# Altium project mb1045.PrjPCB (part 2 of 3)

## Sheet Memory.SchDoc
size A4; Revision: B.2(PCB.SCH)
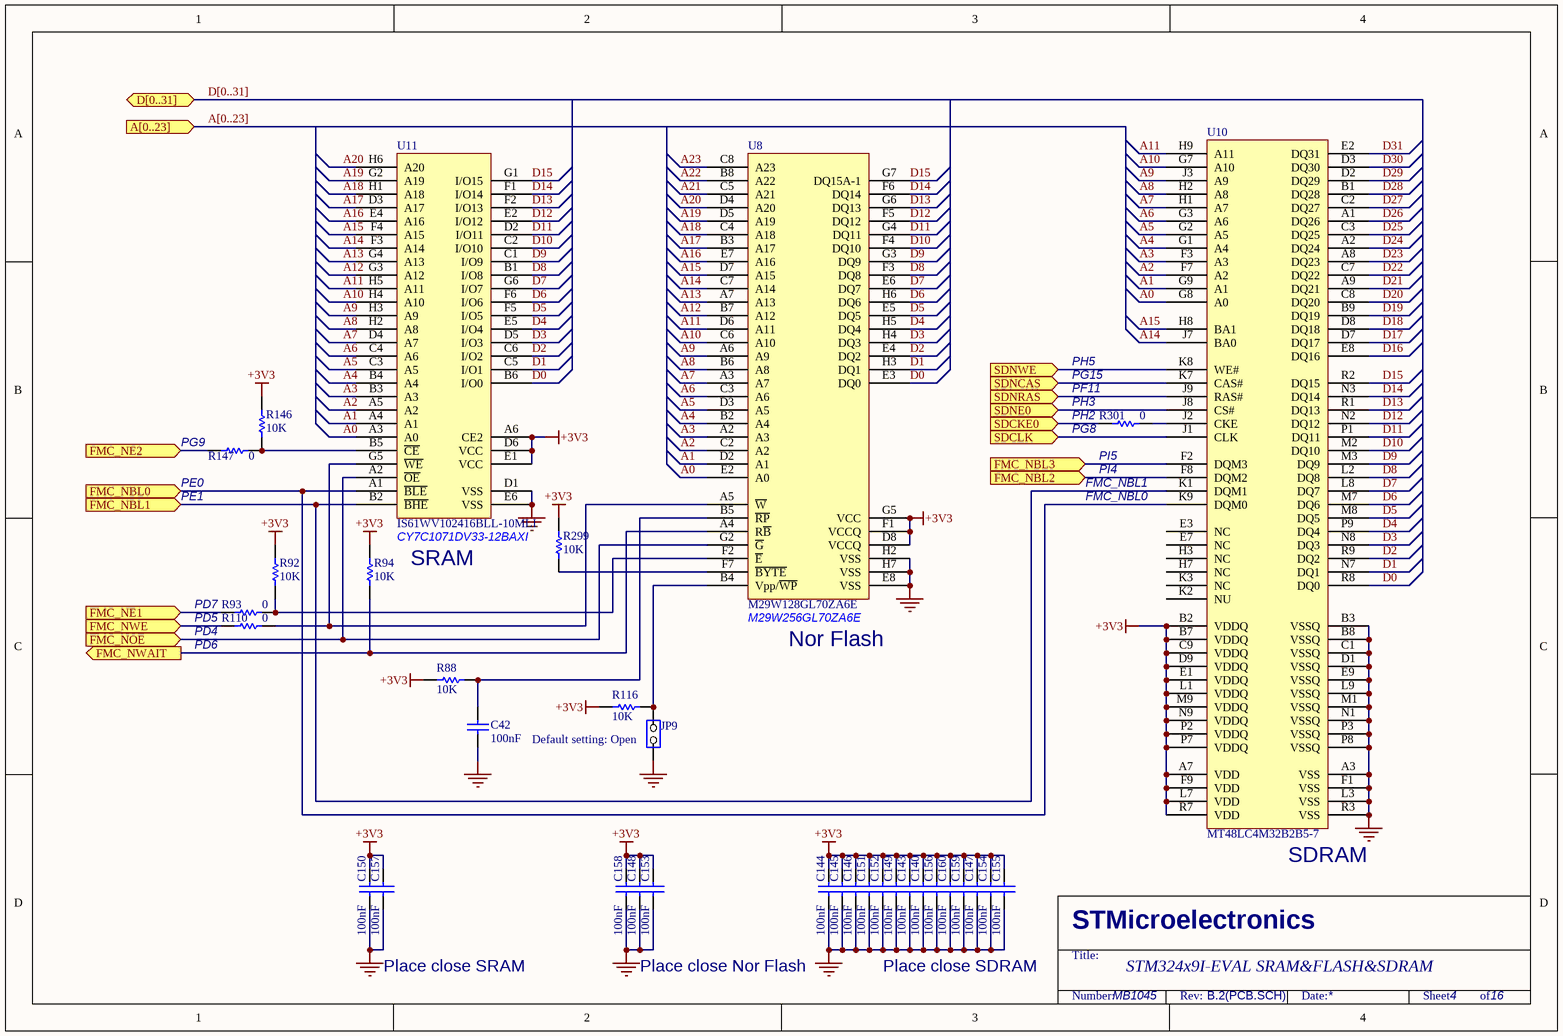
[diagram p4: Memory.SchDoc]

### Parts
C42  100nF  [0603C]
C140  100nF  [0603C]
C143  100nF  [0603C]
C144  100nF  [0603C]
C145  100nF  [0603C]
C146  100nF  [0603C]
C147  100nF  [0603C]
C148  100nF  [0603C]
C149  100nF  [0603C]
C150  100nF  [0603C]
C151  100nF  [0603C]
C152  100nF  [0603C]
C153  100nF  [0603C]
C154  100nF  [0603C]
C155  100nF  [0603C]
C156  100nF  [0603C]
C157  100nF  [0603C]
C158  100nF  [0603C]
C159  100nF  [0603C]
C160  100nF  [0603C]
JP9  (no value)  [SIP2]
R88  10K  [0603R]
R92  10K  [0603R]
R93  0  [0603R]
R94  10K  [0603R]
R110  0  [0603R]
R116  10K  [0603R]
R146  10K  [0603R]
R147  0  [0603R]
R299  10K  [0603R]
R301  0  [0603R]
U8  M29W128GL70ZA6E  [BGA64_1_10X13]
U10  MT48LC4M32B2B5-7  [FBGA90_0R8_8X13]
U11  IS61WV102416BLL-10MLI  [BGA48_0R75_9X11]

### Ports
A[0..23] (in), D[0..31] (bidir), FMC_NBL0 (in), FMC_NBL1 (in), FMC_NBL2 (in), FMC_NBL3 (in), FMC_NE1 (in), FMC_NE2 (in), FMC_NOE (in), FMC_NWAIT (out), FMC_NWE (in), SDCKE0 (in), SDCLK (in), SDNCAS (in), SDNE0 (in), SDNRAS (in), SDNWE (in)

### Nets
+3V3: C140.1 C143.1 C144.1 C145.1 C146.1 C147.1 C148.1 C149.1 C150.1 C151.1 C152.1 C153.1 C154.1 C155.1 C156.1 C157.1 C158.1 C159.1 C160.1 R88.1 R92.2 R94.2 R116.2 R146.2 R299.2 U8.D8(VCCQ) U8.F1(VCCQ) U8.G5(VCC) U10.A7(VDD) U10.B2(VDDQ) U10.B7(VDDQ) U10.C9(VDDQ) U10.D9(VDDQ) U10.E1(VDDQ) U10.F9(VDD) U10.L1(VDDQ) U10.L7(VDD) U10.M9(VDDQ) U10.N9(VDDQ) U10.P2(VDDQ) U10.P7(VDDQ) U10.R7(VDD) U11.A6(CE2) U11.D6(VCC) U11.E1(VCC)
GND: C42.2 C140.2 C143.2 C144.2 C145.2 C146.2 C147.2 C148.2 C149.2 C150.2 C151.2 C152.2 C153.2 C154.2 C155.2 C156.2 C157.2 C158.2 C159.2 C160.2 JP9.1(COMMON) U8.E8(VSS) U8.H2(VSS) U8.H7(VSS) U10.A3(VSS) U10.B3(VSSQ) U10.B8(VSSQ) U10.C1(VSSQ) U10.D1(VSSQ) U10.E9(VSSQ) U10.F1(VSS) U10.L3(VSS) U10.L9(VSSQ) U10.M1(VSSQ) U10.N1(VSSQ) U10.P3(VSSQ) U10.P8(VSSQ) U10.R3(VSS) U11.D1(VSS) U11.E6(VSS)
A0: U8.E2(A0) U10.G8(A0) U11.A3(A0)
A1: U8.D2(A1) U10.G9(A1) U11.A4(A1)
A2: U8.C2(A2) U10.F7(A2) U11.A5(A2)
A3: U8.A2(A3) U10.F3(A3) U11.B3(A3)
A4: U8.B2(A4) U10.G1(A4) U11.B4(A4)
A5: U8.D3(A5) U10.G2(A5) U11.C3(A5)
A6: U8.C3(A6) U10.G3(A6) U11.C4(A6)
A7: U8.A3(A7) U10.H1(A7) U11.D4(A7)
A8: U8.B6(A8) U10.H2(A8) U11.H2(A8)
A9: U8.A6(A9) U10.J3(A9) U11.H3(A9)
A10: U8.C6(A10) U10.G7(A10) U11.H4(A10)
A11: U8.D6(A11) U10.H9(A11) U11.H5(A11)
A12: U8.B7(A12) U11.G3(A12)
A13: U8.A7(A13) U11.G4(A13)
A14: U8.C7(A14) U10.J7(BA0) U11.F3(A14)
A15: U8.D7(A15) U10.H8(BA1) U11.F4(A15)
A16: U8.E7(A16) U11.E4(A16)
A17: U8.B3(A17) U11.D3(A17)
A18: U8.C4(A18) U11.H1(A18)
A19: U8.D5(A19) U11.G2(A19)
A20: U8.D4(A20) U11.H6(A20)
A21: U8.C5(A21)
A22: U8.B8(A22)
A23: U8.C8(A23)
D0: U8.E3(DQ0) U10.R8(DQ0) U11.B6(I/O0)
D1: U8.H3(DQ1) U10.N7(DQ1) U11.C5(I/O1)
D2: U8.E4(DQ2) U10.R9(DQ2) U11.C6(I/O2)
D3: U8.H4(DQ3) U10.N8(DQ3) U11.D5(I/O3)
D4: U8.H5(DQ4) U10.P9(DQ4) U11.E5(I/O4)
D5: U8.E5(DQ5) U10.M8(DQ5) U11.F5(I/O5)
D6: U8.H6(DQ6) U10.M7(DQ6) U11.F6(I/O6)
D7: U8.E6(DQ7) U10.L8(DQ7) U11.G6(I/O7)
D8: U8.F3(DQ8) U10.L2(DQ8) U11.B1(I/O8)
D9: U8.G3(DQ9) U10.M3(DQ9) U11.C1(I/O9)
D10: U8.F4(DQ10) U10.M2(DQ10) U11.C2(I/O10)
D11: U8.G4(DQ11) U10.P1(DQ11) U11.D2(I/O11)
D12: U8.F5(DQ12) U10.N2(DQ12) U11.E2(I/O12)
D13: U8.G6(DQ13) U10.R1(DQ13) U11.F2(I/O13)
D14: U8.F6(DQ14) U10.N3(DQ14) U11.F1(I/O14)
D15: U8.G7(DQ15A-1) U10.R2(DQ15) U11.G1(I/O15)
D16: U10.E8(DQ16)
D17: U10.D7(DQ17)
D18: U10.D8(DQ18)
D19: U10.B9(DQ19)
D20: U10.C8(DQ20)
D21: U10.A9(DQ21)
D22: U10.C7(DQ22)
D23: U10.A8(DQ23)
D24: U10.A2(DQ24)
D25: U10.C3(DQ25)
D26: U10.A1(DQ26)
D27: U10.C2(DQ27)
D28: U10.B1(DQ28)
D29: U10.D2(DQ29)
D30: U10.D3(DQ30)
D31: U10.E2(DQ31)
PD4: U8.G2(~{G}) U11.A2(~{OE}) ; port FMC_NOE
PD5: R110.2 ; port FMC_NWE
PD7: R93.2 ; port FMC_NE1
PE0: U10.K9(DQM0) U11.A1(~{BLE}) ; port FMC_NBL0
PE1: U10.K1(DQM1) U11.B2(~{BHE}) ; port FMC_NBL1
PF11: U10.J9(RAS#) ; port SDNRAS
PG8: U10.J1(CLK) ; port SDCLK
PG9: R147.2 ; port FMC_NE2
PG15: U10.K7(CAS#) ; port SDNCAS
PH2: R301.2 ; port SDCKE0
PH3: U10.J8(CS#) ; port SDNE0
PH5: U10.K8(WE#) ; port SDNWE
PI4: U10.F8(DQM2) ; port FMC_NBL2
PI5: U10.F2(DQM3) ; port FMC_NBL3
NetC42_1: C42.1 R88.2 U8.B5(~{RP})
NetCN12_6: R94.1 U8.A4(R~{B}) ; port FMC_NWAIT
NetJP9_2: JP9.2(NO) R116.1 U8.B4(Vpp/~{WP})
NetR92_1: R92.1 R93.1 U8.F2(~{E})
NetR110_1: R110.1 U8.A5(~{W}) U11.G5(~{WE})
NetR146_1: R146.1 R147.1 U11.B5(~{CE})
NetR299_1: R299.1 U8.F7(~{BYTE})
NetR301_1: R301.1 U10.J2(CKE)

Not connected (* = marked no-connect by the designer): U10 E3(NC) E7(NC) H3(NC) H7(NC) K2(NU) K3(NC)

### Buses and harness runs
bus A[0..23] = port A[0..23]
bus D[0..31] = port D[0..31]

### Notes on the sheet
- PH5
- (near R301) PG15
- (near R147) PG9
- (near R301) PF11
- (near R301) PH3
- (near R301) PH2
- (near R301) PG8
- (near R147) PE1
- (near R147) PE0
- FMC_NBL1
- FMC_NBL0
- (near R301) PI5
- (near R301) PI4
- CY7C1071DV33-12BAXI
- SRAM
- PD5
- PD7
- PD6
- PD4
- (near U8) M29W256GL70ZA6E
- (near U8) Nor Flash
- (near JP9) Default setting: Open
- (near U10) SDRAM
- Place close SRAM
- Place close Nor Flash
- Place close SDRAM
- STM324x9I-EVAL SRAM&FLASH&SDRAM
- MB1045
- 4
- 16
- STMicroelectronics
- Title:
- Number:
- Rev:
- Date:
- Sheet          of

### Library data of the parts
C42 C140 C143-C160 = Cap: Capacitor; Value: 10nF; Published: 8-Jun-2000; Revision: July-2002: Re-released for DXP Platform.; Publisher: Altium Limited
JP9 = JP2
R88 R92-R94 R110 R116 R146 R147 R299 R301 = Res1: Resistor; Value: 1K; Published: 8-Jun-2000; Revision: July-2002: Re-released for DXP Platform.; Publisher: Altium Limited
U8 = M29W128FL70ZA6E
U10 = MT48LC4M32B2B5

## Sheet MotorControl.SchDoc
size A4; Revision: B.2(PCB.SCH)
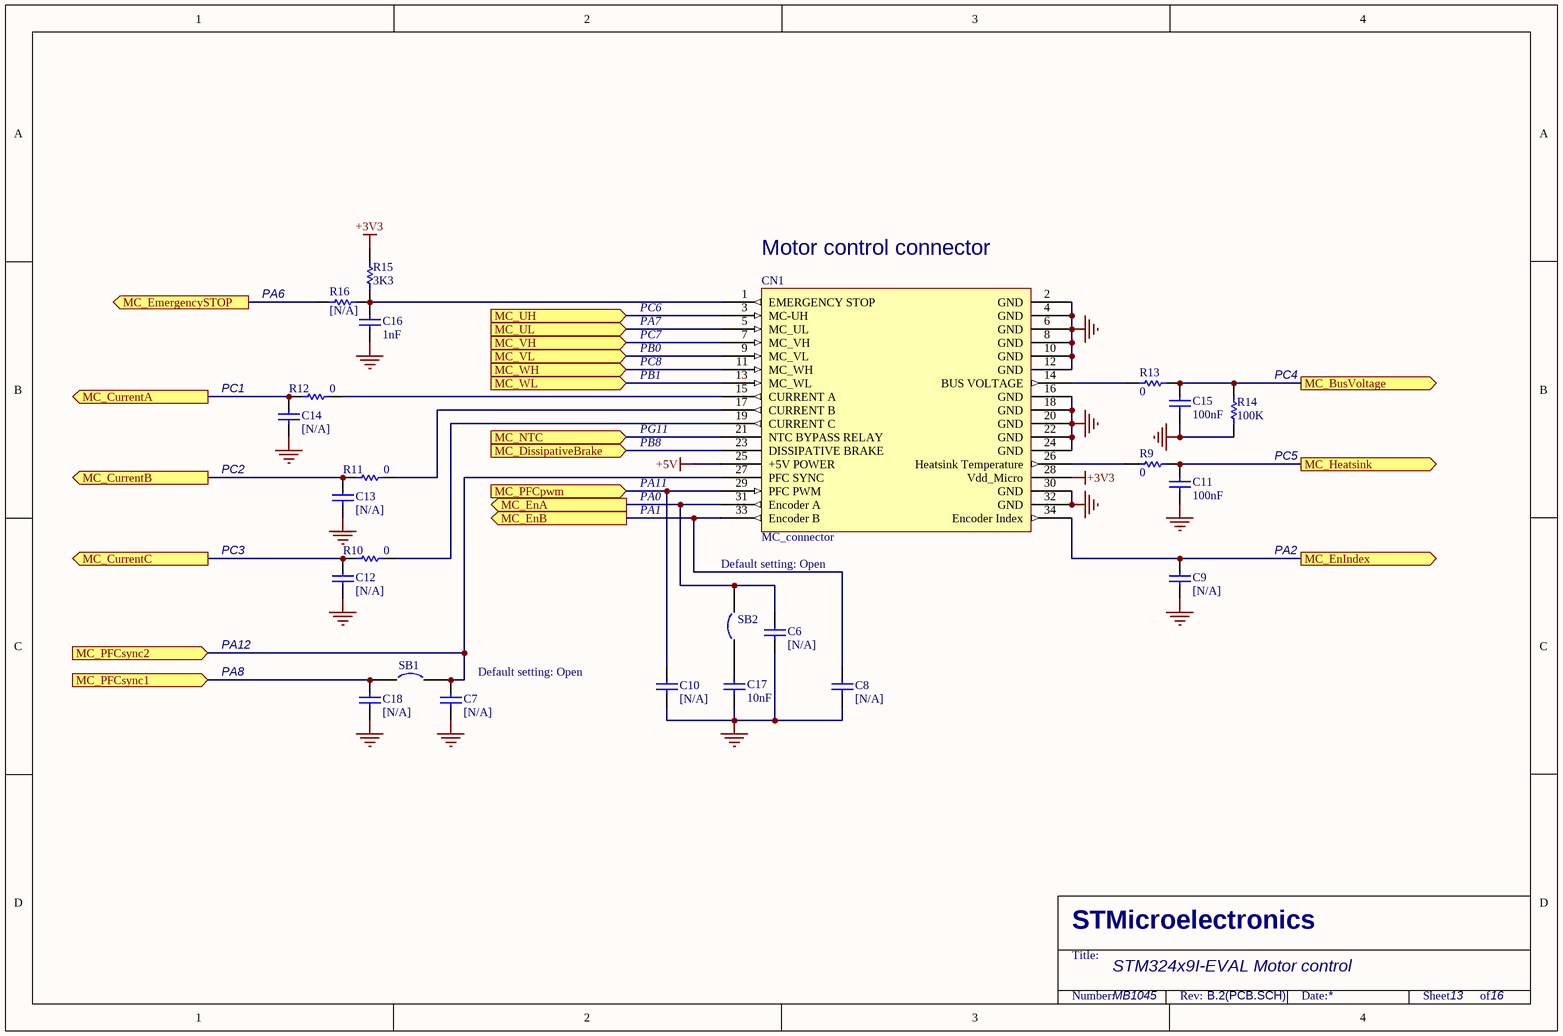
[diagram p5: MotorControl.SchDoc]

### Parts
C6  [N/A]  [0603C]
C7  [N/A]  [0603C]
C8  [N/A]  [0603C]
C9  [N/A]  [0603C]
C10  [N/A]  [0603C]
C11  100nF  [0603C]
C12  [N/A]  [0603C]
C13  [N/A]  [0603C]
C14  [N/A]  [0603C]
C15  100nF  [0603C]
C16  1nF  [0603C]
C17  10nF  [0603C]
C18  [N/A]  [0603C]
CN1  MC_connector  [IDC34S]
R9  0  [0603R]
R10  0  [0603R]
R11  0  [0603R]
R12  0  [0603R]
R13  0  [0603R]
R14  100K  [0603R]
R15  3K3  [0603R]
R16  [N/A]  [0603R]
SB1  (no value)  [JP2_SMD]
SB2  (no value)  [JP2_SMD]

### Ports
MC_BusVoltage (out), MC_CurrentA (out), MC_CurrentB (out), MC_CurrentC (out), MC_DissipativeBrake (in), MC_EmergencySTOP (out), MC_EnA (out), MC_EnB (out), MC_EnIndex (out), MC_Heatsink (out), MC_NTC (in), MC_PFCpwm (in), MC_PFCsync1 (in), MC_PFCsync2 (in), MC_UH (in), MC_UL (in), MC_VH (in), MC_VL (in), MC_WH (in), MC_WL (in)

### Nets
+3V3: CN1.28(Vdd_Micro) R15.2
+5V: CN1.25(+5V_POWER)
GND: C6.1 C7.1 C8.1 C9.1 C10.1 C11.2 C12.1 C13.1 C14.1 C15.2 C16.1 C17.2 C18.1 CN1.2(GND) CN1.4(GND) CN1.6(GND) CN1.8(GND) CN1.10(GND) CN1.12(GND) CN1.16(GND) CN1.18(GND) CN1.20(GND) CN1.22(GND) CN1.24(GND) CN1.30(GND) CN1.32(GND) R14.2
PA6: R16.2 ; port MC_EmergencySTOP
PAR_D1: CN1.7(MC_VH) ; port MC_VH
NetC6_2: C6.2 CN1.31(Encoder_A) SB2.2 ; port MC_EnA
NetC7_2: C7.2 CN1.27(PFC_SYNC) SB1.2 ; port MC_PFCsync2
NetC8_2: C8.2 CN1.33(Encoder_B) ; port MC_EnB
NetC9_2: C9.2 CN1.34(Encoder_Index) ; port MC_EnIndex
NetC10_2: C10.2 CN1.29(PFC_PWM) ; port MC_PFCpwm
NetC11_1: C11.1 R9.2 ; port MC_Heatsink
NetC12_2: C12.2 R10.1 ; port MC_CurrentC
NetC13_2: C13.2 R11.1 ; port MC_CurrentB
NetC14_2: C14.2 R12.1 ; port MC_CurrentA
NetC15_1: C15.1 R13.2 R14.1 ; port MC_BusVoltage
NetC16_2: C16.2 CN1.1(EMERGENCY_STOP) R15.1 R16.1
NetC17_1: C17.1 SB2.1
NetC18_2: C18.2 SB1.1 ; port MC_PFCsync1
NetCN1_3: CN1.3(MC-UH) ; port MC_UH
NetCN1_5: CN1.5(MC_UL) ; port MC_UL
NetCN1_9: CN1.9(MC_VL) ; port MC_VL
NetCN1_11: CN1.11(MC_WH) ; port MC_WH
NetCN1_13: CN1.13(MC_WL) ; port MC_WL
NetCN1_14: CN1.14(BUS_VOLTAGE) R13.1
NetCN1_15: CN1.15(CURRENT_A) R12.2
NetCN1_17: CN1.17(CURRENT_B) R11.2
NetCN1_19: CN1.19(CURRENT_C) R10.2
NetCN1_21: CN1.21(NTC_BYPASS_RELAY) ; port MC_NTC
NetCN1_23: CN1.23(DISSIPATIVE_BRAKE) ; port MC_DissipativeBrake
NetCN1_26: CN1.26(Heatsink_Temperature) R9.1

### Notes on the sheet
- (near R16) PA6
- PC6
- (near CN1) Motor control connector
- PA7
- PB0
- PB1
- PC7
- PC8
- (near R14) PC4
- PC1
- PG11
- PB8
- PC2
- PA1
- PA0
- PA11
- (near R14) PC5
- PC3
- Default setting: Open
- PA2
- PA12
- PA8
- (near C7) Default setting: Open
- STM324x9I-EVAL Motor control
- MB1045
- 13
- 16
- STMicroelectronics
- Title:
- Number:
- Rev:
- Date:
- Sheet          of

### Library data of the parts
C6-C10 C12-C14 C18 = cap: Capacitor; Value: 100pF; Published: 8-Jun-2000; Revision: July-2002: Re-released for DXP Platform.; Publisher: Altium Limited
C11 C15 = Cap: Capacitor; Value: 10nF; Published: 8-Jun-2000; Revision: July-2002: Re-released for DXP Platform.; Publisher: Altium Limited
C16 C17 = CAP: Capacitor; Value: 100pF; Published: 8-Jun-2000; Revision: July-2002: Re-released for DXP Platform.; Publisher: Altium Limited
R9-R13 R15 R16 = Res1: Resistor; Value: 1K; Published: 8-Jun-2000; Revision: July-2002: Re-released for DXP Platform.; Publisher: Altium Limited
R14 = res1: Resistor; Value: 1K; Published: 8-Jun-2000; Revision: July-2002: Re-released for DXP Platform.; Publisher: Altium Limited
SB1 SB2 = Circuit Breaker: Published: 24-Mar-1999; Revision: July-2002: Re-released for DXP Platform.; Publisher: Altium Limited

## Sheet Peripherals.SchDoc
size A4; Revision: B.2(PCB.SCH)
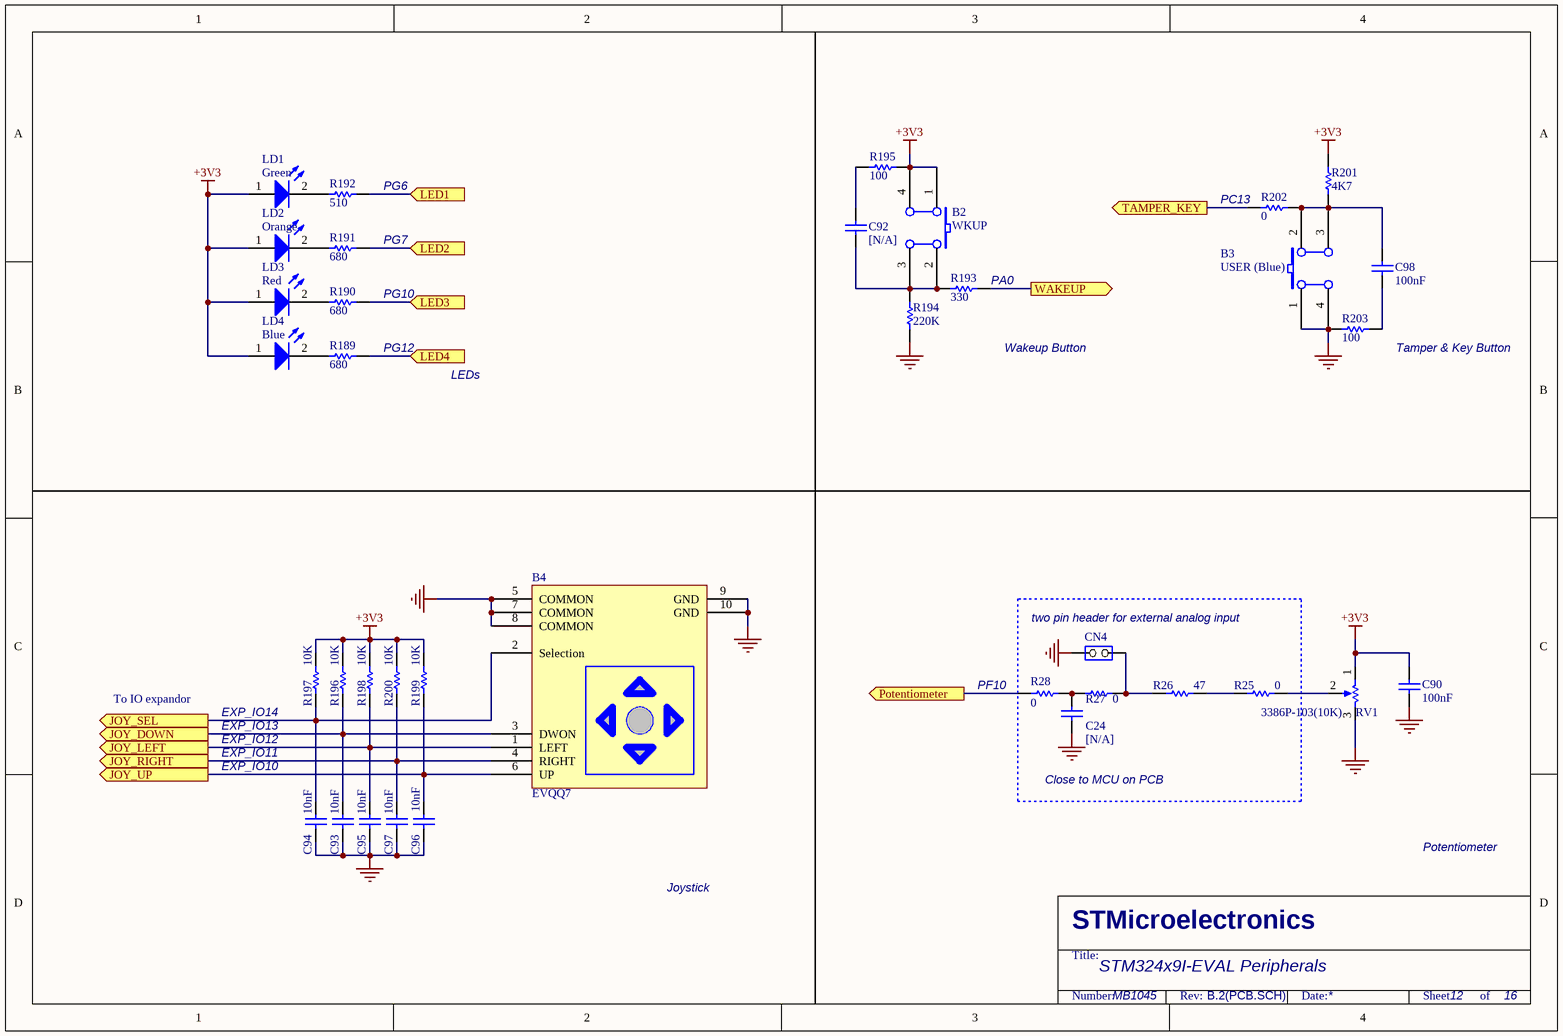
[diagram p6: Peripherals.SchDoc]

### Parts
B2  WKUP  [PB10]
B3  USER (Blue)  [PB10]
B4  EVQQ7  [SW-JOY]
C24  [N/A]  [0603C]
C90  100nF  [0603C]
C92  [N/A]  [0603C]
C93  10nF  [0603C]
C94  10nF  [0603C]
C95  10nF  [0603C]
C96  10nF  [0603C]
C97  10nF  [0603C]
C98  100nF  [0603C]
CN4  (no value)  [SIP2]
LD1  Green  [0603D]
LD2  Orange  [0603D]
LD3  Red  [0603D]
LD4  Blue  [0603D]
R25  0  [0603R]
R26  47  [0603R]
R27  0  [0603R]
R28  0  [0603R]
R189  680  [0603R]
R190  680  [0603R]
R191  680  [0603R]
R192  510  [0603R]
R193  330  [0603R]
R194  220K  [0603R]
R195  100  [0603R]
R196  10K  [0603R]
R197  10K  [0603R]
R198  10K  [0603R]
R199  10K  [0603R]
R200  10K  [0603R]
R201  4K7  [0603R]
R202  0  [0603R]
R203  100  [0603R]
RV1  3386P-103(10K)  [3386P]

### Ports
JOY_DOWN (out), JOY_LEFT (out), JOY_RIGHT (out), JOY_SEL (out), JOY_UP (out), LED1 (in), LED2 (in), LED3 (in), LED4 (in), Potentiometer (out), TAMPER_KEY (out), WAKEUP (out)

### Nets
+3V3: B2.1(A0) B2.4(A1) C90.1 LD1.1(A) LD2.1(A) LD3.1(A) LD4.1(A) R195.1 R196.1 R197.1 R198.1 R199.1 R200.1 R201.2 RV1.1(BOT)
GND: B3.1(A0) B3.4(A1) B4.5(COMMON) B4.7(COMMON) B4.8(COMMON) B4.9(GND) B4.10(GND) C24.1 C90.2 C93.1 C94.1 C95.1 C96.1 C97.1 CN4.2(NO) R194.2 R203.1 RV1.3(TOP)
PC13: R202.2 ; port TAMPER_KEY
PF10: R28.2 ; port Potentiometer
PG6: R192.1 ; port LED1
PG7: R191.1 ; port LED2
PG10: R190.1 ; port LED3
PG12: R189.1 ; port LED4
NetB2_2: B2.2(B0) B2.3(B1) C92.2 R193.1 R194.1
NetB3_2: B3.2(B0) B3.3(B1) C98.2 R201.1 R202.1
NetB4_1: B4.1(LEFT) C95.2 R198.2 ; port JOY_LEFT
NetB4_2: B4.2(Selection) C94.2 R197.2 ; port JOY_SEL
NetB4_3: B4.3(DWON) C93.2 R196.2 ; port JOY_DOWN
NetB4_4: B4.4(RIGHT) C97.2 R200.2 ; port JOY_RIGHT
NetB4_6: B4.6(UP) C96.2 R199.2 ; port JOY_UP
NetC24_2: C24.2 R27.1 R28.1
NetC92_1: C92.1 R195.2
NetC98_1: C98.1 R203.2
NetCN4_1: CN4.1(COMMON) R26.1 R27.2
NetLD1_2: LD1.2(K) R192.2
NetLD2_2: LD2.2(K) R191.2
NetLD3_2: LD3.2(K) R190.2
NetLD4_2: LD4.2(K) R189.2
NetR25_1: R25.1 R26.2
NetR25_2: R25.2 RV1.2(TAP)
NetR193_2: R193.2 ; port WAKEUP

### Notes on the sheet
- (near R192) PG6
- (near R191) PG7
- (near R202) PC13
- (near R190) PG10
- (near R193) PA0
- (near R189) PG12
- LEDs
- Wakeup Button
- (near R203) Tamper & Key Button
- (near CN4) two pin header for external analog input
- To IO expandor
- EXP_IO14
- (near R28) PF10
- EXP_IO10
- EXP_IO11
- EXP_IO12
- EXP_IO13
- Close to MCU on PCB
- Potentiometer
- Joystick
- STM324x9I-EVAL Peripherals
- MB1045
- 12
- 16
- STMicroelectronics
- Title:
- Number:
- Rev:
- Date:
- Sheet          of

### Library data of the parts
B2 B3 = SW PUSHBUTTON: SE PUSHBUTTON
C24 = cap: Capacitor; Value: 100pF; Published: 8-Jun-2000; Revision: July-2002: Re-released for DXP Platform.; Publisher: Altium Limited
C90 C92-C98 = CAP: Capacitor; Value: 100pF; Published: 8-Jun-2000; Revision: July-2002: Re-released for DXP Platform.; Publisher: Altium Limited
CN4 = JP2
LD1-LD4 = LED2: Typical RED, GREEN, YELLOW, AMBER GaAs LED; Published: 8-Jun-2000; Revision: July-2002: Re-released for DXP Platform.; Publisher: Altium Limited
R25-R28 R189-R193 R195 R202 R203 = Res1: Resistor; Value: 1K; Published: 8-Jun-2000; Revision: July-2002: Re-released for DXP Platform.; Publisher: Altium Limited
R194 R196-R201 = res1: Resistor; Value: 1K; Published: 8-Jun-2000; Revision: July-2002: Re-released for DXP Platform.; Publisher: Altium Limited
RV1 = RV

## Sheet Power.SchDoc
size A4; Revision: B.2(PCB.SCH)
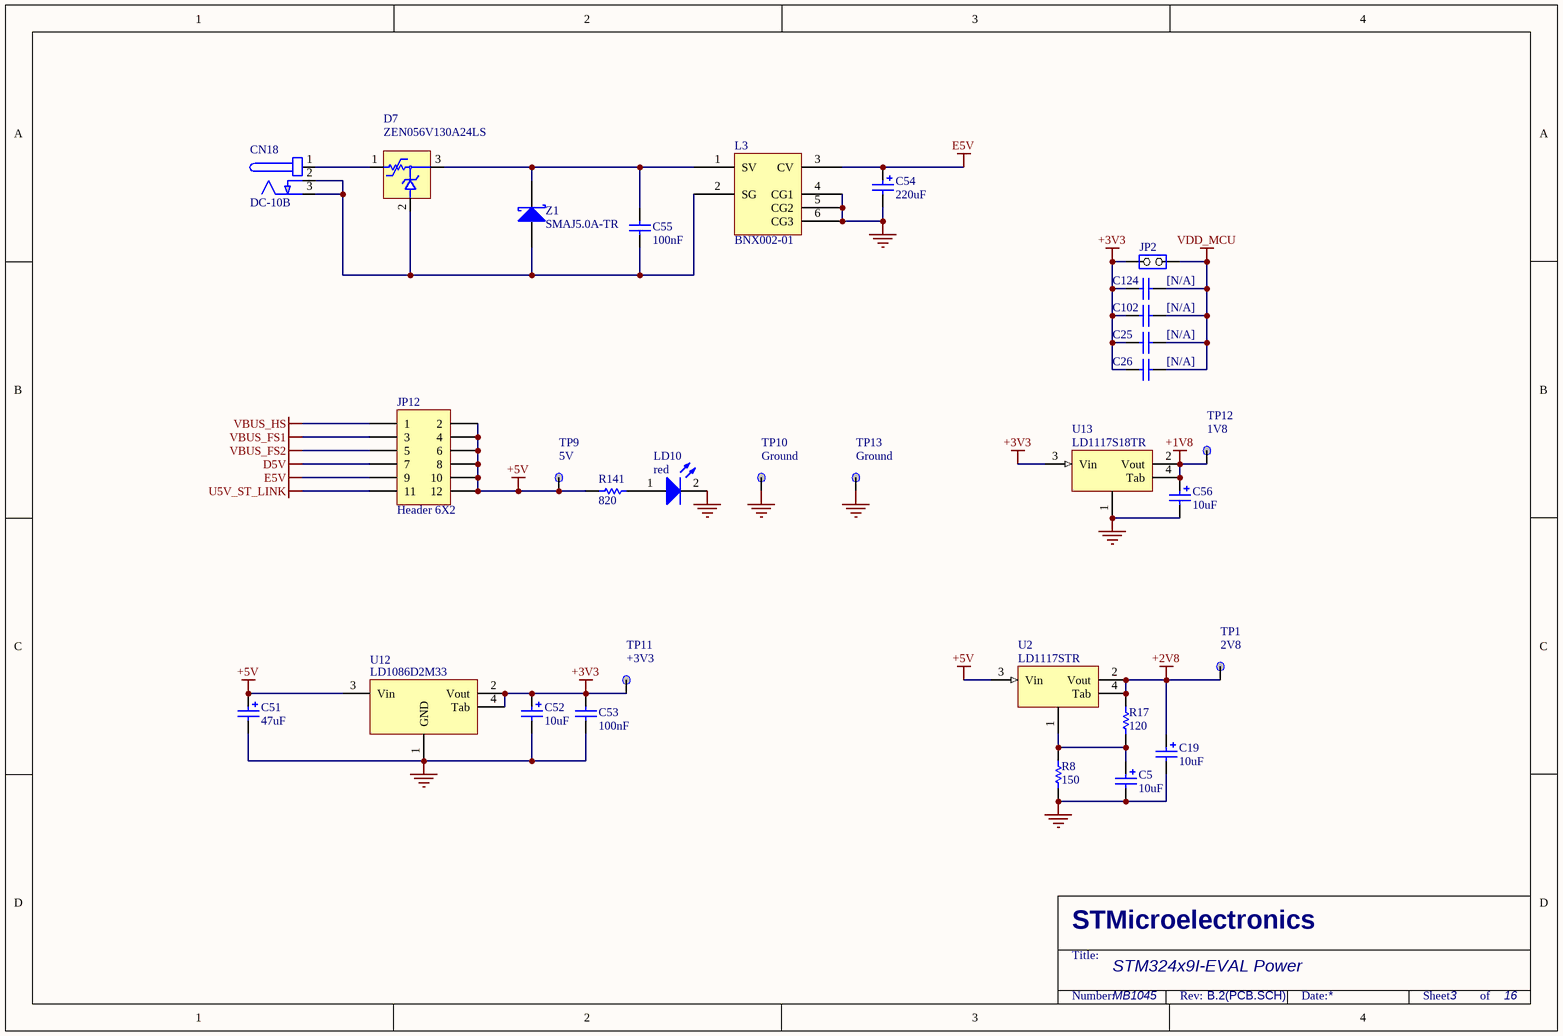
[diagram p7: Power.SchDoc]

### Parts
C5  10uF  [TAN-A]
C19  10uF  [TAN-A]
C25  [N/A]  [0603C]
C26  [N/A]  [0603C]
C51  47uF  [CAE_5R3X5R3_H5R4]
C52  10uF  [TAN-A]
C53  100nF  [0603C]
C54  220uF  [c310m-6]
C55  100nF  [0603C]
C56  10uF  [TAN-A]
C102  [N/A]  [0603C]
C124  [N/A]  [0603C]
CN18  DC-10B  [PWR_JACK_DC10]
D7  ZEN056V130A24LS  [TYCO_ZEN056V130A24LS]
JP2  (no value)  [SIP2]
JP12  Header 6X2  [HDR_2X6_2R54]
L3  BNX002-01  [BNX001]
LD10  red  [0603D]
R8  150  [0603R]
R17  120  [0603R]
R141  820  [0603R]
TP1  2V8  [TP]
TP9  5V  [TP]
TP10  Ground  [TP]
TP11  +3V3  [TP]
TP12  1V8  [TP]
TP13  Ground  [TP]
U2  LD1117STR  [SOT-223]
U12  LD1086D2M33  [TO263-3]
U13  LD1117S18TR  [SOT-223]
Z1  SMAJ5.0A-TR  [sma]

### Nets
+1V8: C56.1 TP12.1 U13.2(Vout) U13.4(Tab)
+2V8: C19.1 R17.1 TP1.1 U2.2(Vout) U2.4(Tab)
+3V3: C25.1 C26.1 C52.1 C53.1 C102.1 C124.1 JP2.1(COMMON) TP11.1 U12.2(Vout) U12.4(Tab) U13.3(Vin)
+5V: C51.1 JP12.2 JP12.4 JP12.6 JP12.8 JP12.10 JP12.12 R141.2 TP9.1 U2.3(Vin) U12.3(Vin)
D5V: JP12.7
E5V: C54.1 JP12.9 L3.3(CV)
GND: C5.2 C19.2 C51.2 C52.2 C53.2 C54.2 C56.2 L3.4(CG1) L3.5(CG2) L3.6(CG3) LD10.2(K) R8.2 TP10.1 TP13.1 U12.1(GND) U13.1
U5V_ST_LINK: JP12.11
VBUS_FS1: JP12.3
VBUS_FS2: JP12.5
VBUS_HS: JP12.1
VDD_MCU: C25.2 C26.2 C102.2 C124.2 JP2.2(NO)
NetC5_1: C5.1 R8.1 R17.2 U2.1
NetC55_1: C55.1 D7.3 L3.1(SV) Z1.2(K)
NetC55_2: C55.2 CN18.2(GND) CN18.3(GND) D7.2 L3.2(SG) Z1.1(A)
NetCN18_1: CN18.1(+) D7.1
NetLD10_1: LD10.1(A) R141.1

### Notes on the sheet
- STM324x9I-EVAL Power
- MB1045
- 3
- 16
- STMicroelectronics
- Title:
- Number:
- Rev:
- Date:
- Sheet          of

### Library data of the parts
C5 C19 C52 C56 = Cap Pol1: Polarized Capacitor (Radial); Published: 8-Jun-2000; Revision: July-2002: Re-released for DXP Platform.; Publisher: Altium Limited; Value: 10uF
C25 C26 C53 C102 C124 = Cap: Capacitor; Value: 10nF; Published: 8-Jun-2000; Revision: July-2002: Re-released for DXP Platform.; Publisher: Altium Limited
C51 = Cap Pol1: Polarized Capacitor (Radial); Value: 10uF; Published: 8-Jun-2000; Revision: July-2002: Re-released for DXP Platform.; Publisher: Altium Limited
C54 = Cap Pol1: Polarized Capacitor (Radial); Value: 47uF; Published: 8-Jun-2000; Revision: July-2002: Re-released for DXP Platform.; Publisher: Altium Limited
C55 = CAP: Capacitor; Value: 100pF; Published: 8-Jun-2000; Revision: July-2002: Re-released for DXP Platform.; Publisher: Altium Limited
CN18 = PJ202A
JP2 = JP2
JP12 = Header 6X2: Header, 6-Pin, Dual row; Revision: 17-Jul-2002: Re-released for DXP Platform.; Publisher: Altium Limited
L3 = BNX002
LD10 = LED2: as LD1 on sheet Peripherals; Published: 8-Jun-2000; Revision: July-2002: Re-released for DXP Platform.; Publisher: Altium Limited
R8 R17 R141 = res1: Resistor; Value: 1K; Published: 8-Jun-2000; Revision: July-2002: Re-released for DXP Platform.; Publisher: Altium Limited
TP1 TP9-TP13 = TP
U2 U13 = LD1117
U12 = VOLTREG1
Z1 = D Schottky: Schottky Diode; Code - JEDEC: DO-214-AA; Published: 8-Jun-2000; Revision: July-2002: Re-released for DXP Platform.; Publisher: Altium Limited

## Sheet RS232&IrDA.SchDoc
size A4; Revision: B.2(PCB.SCH)
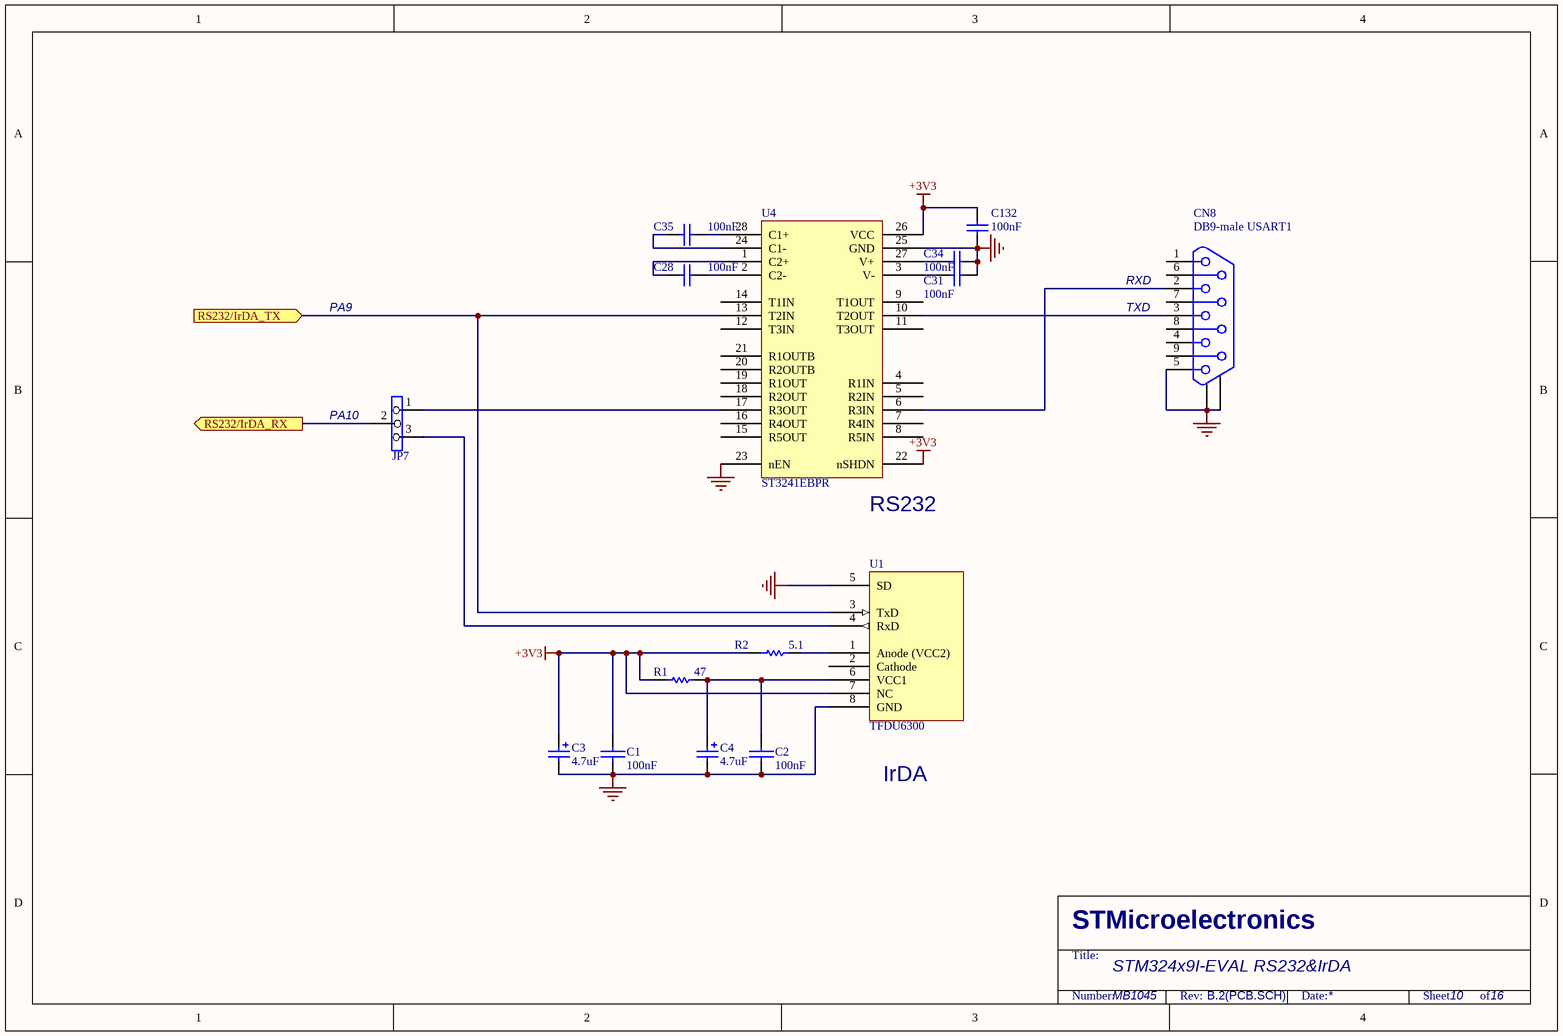
[diagram p8: RS232&IrDA.SchDoc]

### Parts
C1  100nF  [0603C]
C2  100nF  [0603C]
C3  4.7uF  [TAN-A]
C4  4.7uF  [TAN-A]
C28  100nF  [0603C]
C31  100nF  [0603C]
C34  100nF  [0603C]
C35  100nF  [0603C]
C132  100nF  [0603C]
CN8  DB9-male USART1  [DB9/M]
JP7  (no value)  [SIP3]
R1  47  [0603R]
R2  5.1  [0603R]
U1  TFDU6300  [IR_VISHAY3]
U4  ST3241EBPR  [SSOP28_0R65_10R2X7R8]

### Ports
RS232/IrDA_RX (out), RS232/IrDA_TX (in)

### Nets
+3V3: C1.1 C3.1 C132.1 R1.1 R2.1 U1.7(NC) U4.22(nSHDN) U4.26(VCC)
GND: C1.2 C2.2 C3.2 C4.2 C31.1 C34.1 C132.2 CN8.5 CN8.10 CN8.11 U1.5(SD) U1.8(GND) U4.23(nEN) U4.25(GND)
PA10: JP7.2 ; port RS232/IrDA_RX
NetC2_1: C2.1 C4.1 R1.2 U1.6(VCC1)
NetC28_1: C28.1 U4.1(C2+)
NetC28_2: C28.2 U4.2(C2-)
NetC31_2: C31.2 U4.3(V-)
NetC34_2: C34.2 U4.27(V+)
NetC35_1: C35.1 U4.24(C1-)
NetC35_2: C35.2 U4.28(C1+)
NetCN8_2: CN8.2 U4.6(R3IN)
NetCN8_3: CN8.3 U4.10(T2OUT)
NetJP7_1: JP7.1 U4.17(R3OUT)
NetJP7_3: JP7.3 U1.4(RxD)
NetR2_2: R2.2 U1.1(Anode_(VCC2))
NetR262_2: U1.3(TxD) U4.13(T2IN) ; port RS232/IrDA_TX

Not connected (* = marked no-connect by the designer): CN8 1 4 6 7 8 9; U1 2(Cathode); U4 4(R1IN) 5(R2IN) 7(R4IN) 8(R5IN) 9(T1OUT) 11(T3OUT) 12(T3IN) 14(T1IN) 15(R5OUT) 16(R4OUT) 18(R2OUT) 19(R1OUT) 20(R2OUTB) 21(R1OUTB)

### Notes on the sheet
- PA9
- (near CN8) RXD
- (near CN8) TXD
- (near JP7) PA10
- (near U4) RS232
- IrDA
- STM324x9I-EVAL RS232&IrDA
- MB1045
- 10
- 16
- STMicroelectronics
- Title:
- Number:
- Rev:
- Date:
- Sheet          of

### Library data of the parts
C1 C2 = CAP: Capacitor
C3 C4 = Cap Pol1: Polarized Capacitor (Radial); Value: 100pF; Published: 8-Jun-2000; Revision: July-2002: Re-released for DXP Platform.; Publisher: Altium Limited
C28 C31 C34 C35 C132 = Cap: Capacitor; Value: 10nF; Published: 8-Jun-2000; Revision: July-2002: Re-released for DXP Platform.; Publisher: Altium Limited
CN8 = DB9-USART
JP7 = Jumper3
R1 R2 = Res1: Resistor; Value: 1K; Published: 8-Jun-2000; Revision: July-2002: Re-released for DXP Platform.; Publisher: Altium Limited
U1 = TFDU4300
U4 = ST3241

## Sheet ST_LINK.SCHDOC
size A4; Revision: B.2(PCB.SCH)
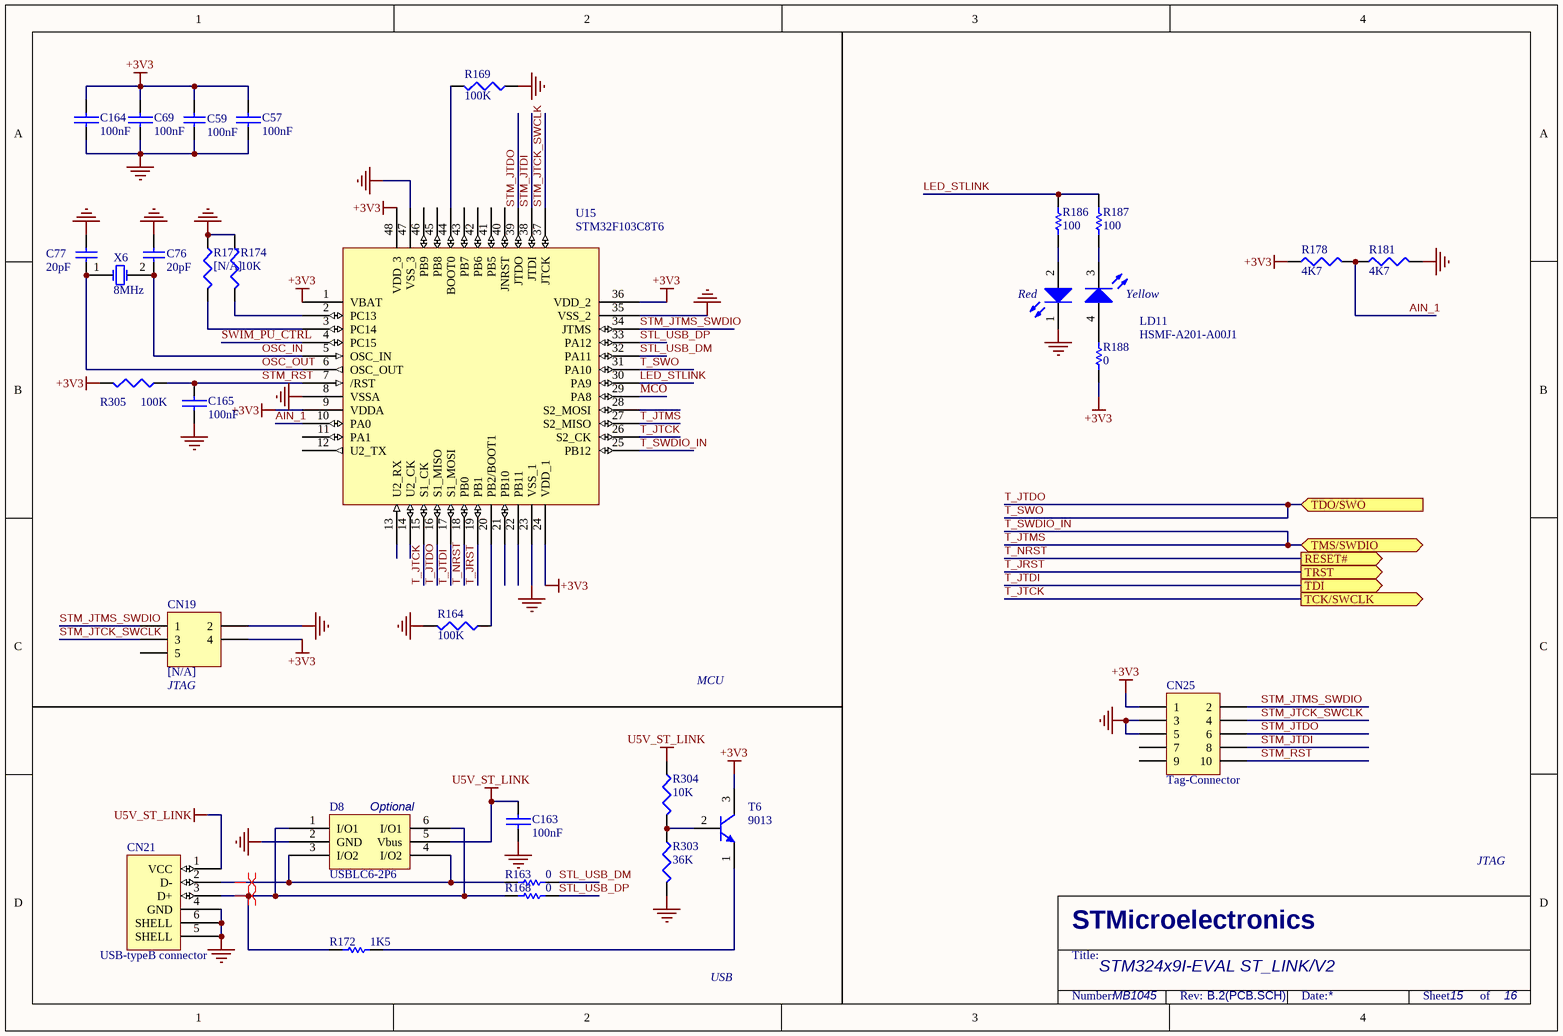
[diagram p9: ST_LINK.SCHDOC]

### Parts
C57  100nF  [0603C]
C59  100nF  [0603C]
C69  100nF  [0603C]
C76  20pF  [0603C]
C77  20pF  [0603C]
C163  100nF  [0603C]
C164  100nF  [0603C]
C165  100nF  [0603C]
CN19  [N/A]  [HDR_2X3-1_2R54-6]
CN21  USB-typeB connector  [USB-B]
CN25  Tag-Connector  [TC2050-IDC-FP]
D8  USBLC6-2P6  [SOT-563]
LD11  HSMF-A201-A00J1  [LED2_3528]
R163  0  [0603R]
R164  100K  [0603R]
R168  0  [0603R]
R169  100K  [0603R]
R172  1K5  [0603R]
R174  10K  [0603R]
R177  [N/A]  [0603R]
R178  4K7  [0603R]
R181  4K7  [0603R]
R186  100  [0603R]
R187  100  [0603R]
R188  0  [0603R]
R303  36K  [0603R]
R304  10K  [0603R]
R305  100K  [0603R]
T6  9013  [SOT23-213]
U15  STM32F103C8T6  [LQFP48_0R5_9X9]
X6  8MHz  [XTAL_2SM_12R7X4R7]

### Ports
RESET# (out), TCK/SWCLK (out), TDI (out), TDO/SWO (in), TMS/SWDIO (bidir), TRST (out)

### Nets
+3V3: C57.2 C59.1 C69.2 C164.2 CN19.4 CN25.1 R178.1 R188.2 R305.2 T6.3(C) U15.1(VBAT) U15.9(VDDA) U15.24(VDD_1) U15.36(VDD_2) U15.48(VDD_3)
GND: C57.1 C59.2 C69.1 C76.1 C77.1 C163.2 C164.1 C165.1 CN19.2 CN21.4(GND) CN21.5(SHELL) CN21.6(SHELL) CN25.3 CN25.5 D8.2(GND) LD11.1(RED_cathode) R164.2 R169.1 R174.1 R177.1 R181.2 R303.2 U15.8(VSSA) U15.23(VSS_1) U15.35(VSS_2) U15.47(VSS_3)
U5V_ST_LINK: C163.1 CN21.1(VCC) D8.5(Vbus) R304.1
AIN_1: R178.2 R181.1 U15.10(PA0)
LED_STLINK: R186.1 R187.1 U15.30(PA9)
MCO: U15.29(PA8)
OSC_IN: C76.2 U15.5(OSC_IN) X6.2(OSC2)
OSC_OUT: C77.2 U15.6(OSC_OUT) X6.1(OSC1)
STL_USB_DM: R163.1 U15.32(PA11)
STL_USB_DP: R168.1 U15.33(PA12)
STM_JTCK_SWCLK: CN19.3 CN25.4 U15.37(JTCK)
STM_JTDI: CN25.8 U15.38(JTDI)
STM_JTDO: CN25.6 U15.39(JTDO)
STM_JTMS_SWDIO: CN19.1 CN25.2 U15.34(JTMS)
STM_RST: C165.2 CN25.10 R305.1 U15.7(/RST)
SWIM_PU_CTRL: U15.4(PC15)
T_JRST: U15.19(PB1) ; port TRST  [project net PB4]
T_JTCK: U15.15(S1_CK) U15.26(S2_CK) ; port TCK/SWCLK  [project net PA14]
T_JTDI: U15.17(S1_MOSI) ; port TDI  [project net PA15]
T_JTDO: U15.16(S1_MISO) U15.31(PA10) ; port TDO/SWO  [also labelled T_SWO]
T_JTMS: U15.25(PB12) U15.27(S2_MISO) ; port TMS/SWDIO  [also labelled T_SWDIO_IN]  [project net PA13]
T_NRST: U15.18(PB0) ; port RESET#  [project net RESET#]
NetCN21_2: CN21.2(D-) D8.3(I/O2) D8.4(I/O2) R163.2
NetCN21_3: CN21.3(D+) D8.1(I/O1) D8.6(I/O1) R168.2 R172.2
NetLD11_2: LD11.2(Red_anode) R186.2
NetLD11_3: LD11.3(YellowGreen_cathode) R187.2
NetLD11_4: LD11.4(YellowGreen_anode) R188.1
NetR164_1: R164.1 U15.20(PB2/BOOT1)
NetR169_2: R169.2 U15.44(BOOT0)
NetR172_1: R172.1 T6.1(E)
NetR174_2: R174.2 U15.2(PC13)
NetR177_2: R177.2 U15.3(PC14)
NetR303_1: R303.1 R304.2 T6.2(B)

Not connected (* = marked no-connect by the designer): CN19 5; CN25 7 9; U15 11(PA1) 12(U2_TX) 13(U2_RX) 14(U2_CK) 21(PB10) 22(PB11) 28(S2_MOSI) 40(JNRST) 41(PB5) 42(PB6) 43(PB7) 45(PB8) 46(PB9)

### Layout directives
differential pair: NetCN21_2, NetCN21_3

### Notes on the sheet
- (near CN19) JTAG
- MCU
- (near D8) Optional
- JTAG
- USB
- STM324x9I-EVAL ST_LINK/V2
- MB1045
- 15
- 16
- STMicroelectronics
- Title:
- Number:
- Rev:
- Date:
- Sheet          of
- (in symbol HSMF-A201-A00J1) Red; Yellow

### Library data of the parts
C57 C69 C164 C165 = CAP
C59 = Cap: Capacitor; Value: 10nF; Published: 8-Jun-2000; Revision: July-2002: Re-released for DXP Platform.; Publisher: Altium Limited
C76 C77 = Cap: Capacitor; Published: 8-Jun-2000; LatestRevisionDate: 17-Jul-2002; LatestRevisionNote: Re-released for DXP Platform.; PackageReference: RAD-0.3; Publisher: Altium Limited; Value: 20pF
C163 = CAP: Capacitor
CN19 = Header 3X2: Header, 3-Pin, Dual row; Revision: 17-Jul-2002: Re-released for DXP Platform.; Publisher: Altium Limited
CN25 = Tag-Connector: Header, 6-Pin, Dual row; Revision: 17-Jul-2002: Re-released for DXP Platform.; Publisher: Altium Limited
D8 = USBLC6-2
R163 R168 R172 R186-R188 = Res1: Resistor; Value: 1K; Published: 8-Jun-2000; Revision: July-2002: Re-released for DXP Platform.; Publisher: Altium Limited
R164 R169 R178 R181 R305 = RES1
R174 R177 R303 R304 = R: Right: 20; Bottom: 30
T6 = NPN: NPN Bipolar Transistor; Code - JEDEC: TO-226-AA; Published: 8-Jun-2000; Revision: July-2002: Re-released for DXP Platform.; Publisher: Altium Limited
U15 = STM32F10x(48pin)
X6 = XTAL: Crystal Oscillator; Published: 8-Jun-2000; LatestRevisionDate: 17-Jul-2002; LatestRevisionNote: Re-released for DXP Platform.; PackageReference: R38; Publisher: Altium Limited

## Sheet USB_OTG.SchDoc
size A4; Revision: B.2(PCB.SCH)
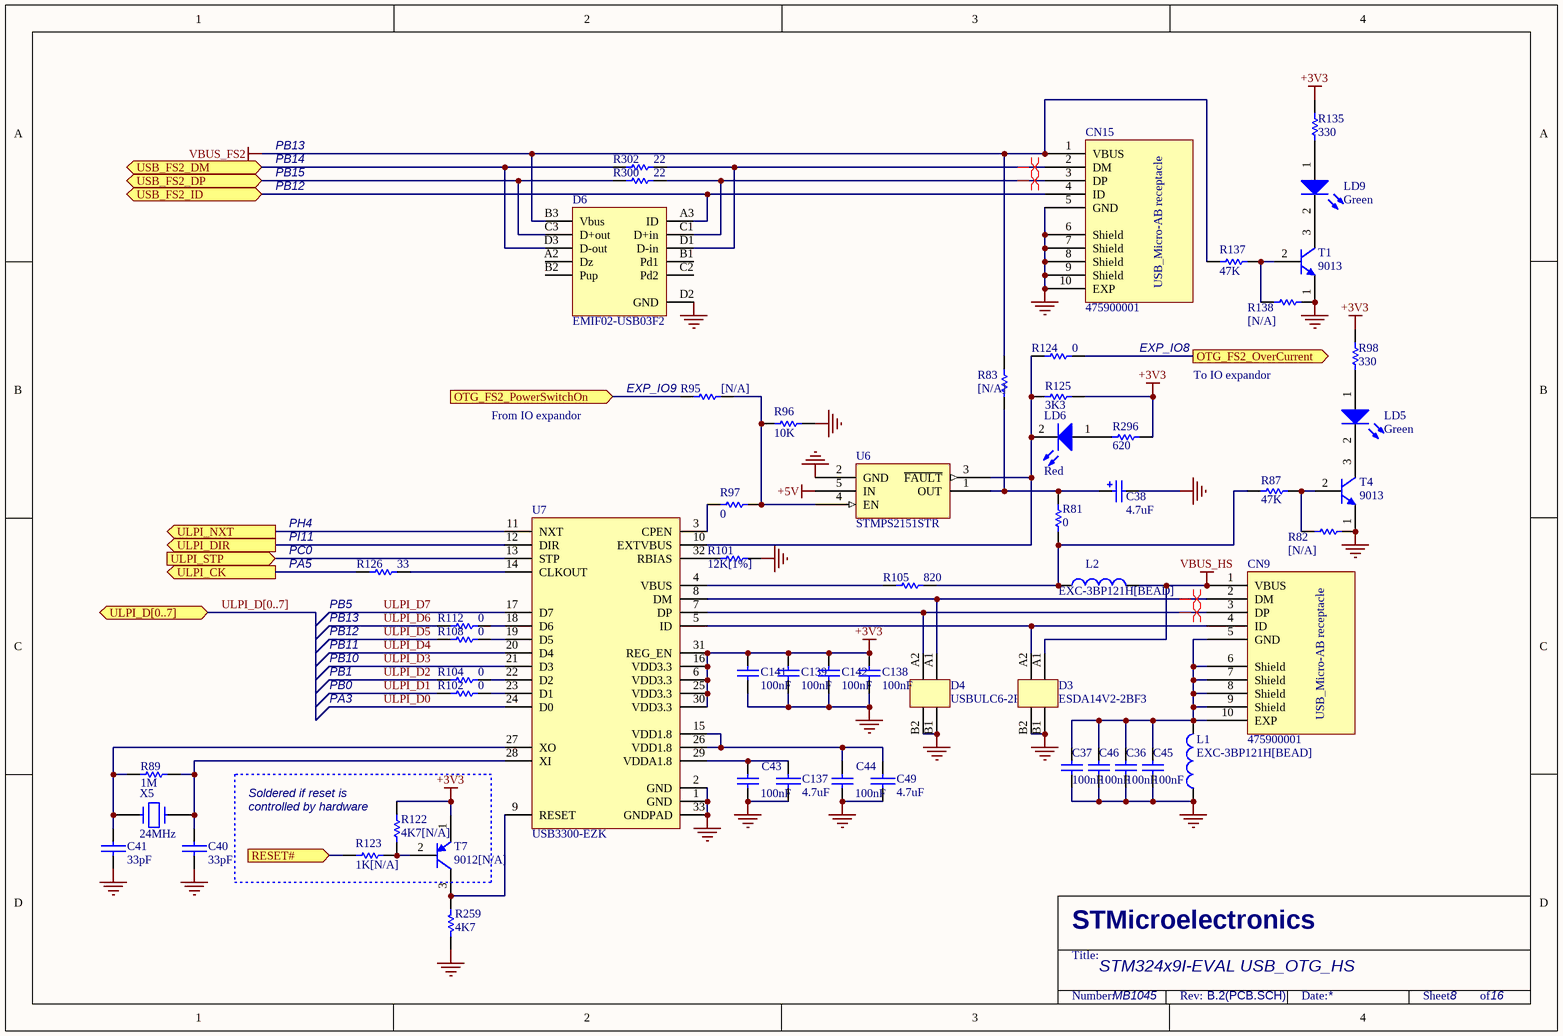
[diagram p10: USB_OTG.SchDoc]

### Parts
C36  100nF  [0603C]
C37  100nF  [0603C]
C38  4.7uF  [TAN-A]
C40  33pF  [0603C]
C41  33pF  [0603C]
C43  100nF  [0603C]
C44  100nF  [0603C]
C45  100nF  [0603C]
C46  100nF  [0603C]
C49  4.7uF  [TAN-A]
C137  4.7uF  [TAN-A]
C138  100nF  [0603C]
C139  100nF  [0603C]
C141  100nF  [0603C]
C142  100nF  [0603C]
CN9  475900001  [MOLEX_47590001]
CN15  475900001  [MOLEX_47590001]
D3  ESDA14V2-2BF3  [BGA4_0R4_0R8X0R8]
D4  USBULC6-2F3  [BGA4_0R4_1X1]
D6  EMIF02-USB03F2  [BGA11_0R5_1R57X2R07]
L1  EXC-3BP121H[BEAD]  [0603L]
L2  EXC-3BP121H[BEAD]  [0603L]
LD5  Green  [0603D]
LD6  Red  [0603D]
LD9  Green  [0603D]
R81  0  [0603R]
R82  [N/A]  [0603R]
R83  [N/A]  [0603R]
R87  47K  [0603R]
R89  1M  [0603R]
R95  [N/A]  [0603R]
R96  10K  [0603R]
R97  0  [0603R]
R98  330  [0603R]
R101  12K[1%]  [0603R]
R102  0  [0603R]
R104  0  [0603R]
R105  820  [0603R]
R108  0  [0603R]
R112  0  [0603R]
R122  4K7[N/A]  [0603R]
R123  1K[N/A]  [0603R]
R124  0  [0603R]
R125  3K3  [0603R]
R126  33  [0603R]
R135  330  [0603R]
R137  47K  [0603R]
R138  [N/A]  [0603R]
R259  4K7  [0603R]
R296  620  [0603R]
R300  22  [0603R]
R302  22  [0603R]
T1  9013  [SOT23-213]
T4  9013  [SOT23-213]
T7  9012[N/A]  [SOT23-213]
U6  STMPS2151STR  [SOT23-5]
U7  USB3300-EZK  [QFN32_0R5_5X5]
X5  24MHz  [XTAL1]

### Ports
OTG_FS2_OverCurrent (out), OTG_FS2_PowerSwitchOn (in), RESET# (in), ULPI_CK (out), ULPI_D[0..7] (bidir), ULPI_DIR (out), ULPI_NXT (out), ULPI_STP (in), USB_FS2_DM (bidir), USB_FS2_DP (bidir), USB_FS2_ID (bidir)

### Nets
+3V3: C138.1 C139.1 C141.1 C142.1 R98.2 R122.1 R125.1 R135.2 R296.2 T7.1(E) U7.6(VDD3.3) U7.16(VDD3.3) U7.25(VDD3.3) U7.30(VDD3.3) U7.31(REG_EN)
+5V: U6.5(IN)
GND: C36.2 C37.2 C38.2 C40.2 C41.2 C43.2 C44.2 C45.2 C46.2 C49.2 C137.2 C138.2 C139.2 C141.2 C142.2 CN15.5(GND) CN15.6(Shield) CN15.7(Shield) CN15.8(Shield) CN15.9(Shield) CN15.10(EXP) D3.B1 D3.B2 D4.B1 D4.B2 D6.D2(GND) L1.1 R82.1 R96.1 R101.1 R138.1 R259.1 T1.1(E) T4.1(E) U6.2(GND) U7.1(GND) U7.2(GND) U7.33(GNDPAD)
VBUS_FS2: CN15.1(VBUS) D6.B3(Vbus) R83.1 R137.1
VBUS_HS: CN9.1(VBUS) D3.A1 L2.2
PA5: R126.2 ; port ULPI_CK
PB14: D6.D3(D-out) R302.2 ; port USB_FS2_DM
PB15: D6.C3(D+out) R300.2 ; port USB_FS2_DP
PC0: U7.13(STP) ; port ULPI_STP
PH4: U7.11(NXT) ; port ULPI_NXT
PI11: U7.12(DIR) ; port ULPI_DIR
RESET#: R123.2 ; port RESET#
ULPI_D0: U7.24(D0)  [project net PA3]
ULPI_D1: R102.2  [project net PB0]
ULPI_D2: R104.2  [project net PB1]
ULPI_D3: U7.21(D3)  [project net PB10]
ULPI_D4: U7.20(D4)  [project net PB11]
ULPI_D5: R108.2  [project net PB12]
ULPI_D6: R112.2  [project net PB13]
ULPI_D7: U7.17(D7)  [project net PB5]
NetC36_1: C36.1 C37.1 C45.1 C46.1 CN9.5(GND) CN9.6(Shield) CN9.7(Shield) CN9.8(Shield) CN9.9(Shield) CN9.10(EXP) L1.2
NetC38_1: C38.1 R81.1 R83.2 U6.1(OUT)
NetC40_1: C40.1 R89.2 U7.28(XI) X5.1
NetC41_1: C41.1 R89.1 U7.27(XO) X5.2
NetC43_1: C43.1 C137.1 U7.29(VDDA1.8)
NetC44_1: C44.1 C49.1 U7.15(VDD1.8) U7.26(VDD1.8)
NetCN9_2: CN9.2(DM) D4.A1 U7.8(DM)
NetCN9_3: CN9.3(DP) D4.A2 U7.7(DP)
NetCN9_4: CN9.4(ID) D3.A2 U7.5(ID)
NetCN15_2: CN15.2(DM) D6.D1(D-in) R302.1
NetCN15_3: CN15.3(DP) D6.C1(D+in) R300.1
NetCN15_4: CN15.4(ID) D6.A3(ID) ; port USB_FS2_ID
NetL2_1: L2.1 R81.2 R87.2 R105.2
NetLD5_1: LD5.1(A) R98.1
NetLD5_2: LD5.2(K) T4.3(C)
NetLD6_1: LD6.1(A) R296.1
NetLD6_2: LD6.2(K) R124.2 R125.2 U6.3(~{FAULT}) U7.10(EXTVBUS)
NetLD9_1: LD9.1(A) R135.1
NetLD9_2: LD9.2(K) T1.3(C)
NetR82_2: R82.2 R87.1 T4.2(B)
NetR95_1: R95.1 R96.2 R97.2 U6.4(EN)
NetR95_2: R95.2 ; port OTG_FS2_PowerSwitchOn
NetR97_1: R97.1 U7.3(CPEN)
NetR101_2: R101.2 U7.32(RBIAS)
NetR102_1: R102.1 U7.23(D1)
NetR104_1: R104.1 U7.22(D2)
NetR105_1: R105.1 U7.4(VBUS)
NetR108_1: R108.1 U7.19(D5)
NetR112_1: R112.1 U7.18(D6)
NetR122_2: R122.2 R123.1 T7.2(B)
NetR124_1: R124.1 ; port OTG_FS2_OverCurrent
NetR126_1: R126.1 U7.14(CLKOUT)
NetR137_2: R137.2 R138.2 T1.2(B)
NetR259_2: R259.2 T7.3(C) U7.9(RESET)

Not connected (* = marked no-connect by the designer): D6 A2(Dz) B1(Pd1) B2(Pup) C2(Pd2)

### Buses and harness runs
bus ULPI_D[0..7] = port ULPI_D[0..7]

### Layout directives
differential pair: NetCN9_2, NetCN9_3, NetCN15_2, NetCN15_3

### Notes on the sheet
- PB13
- PB14
- PB15
- PB12
- EXP_IO8
- To IO expandor
- From IO expandor
- (near R95) EXP_IO9
- PH4
- PI11
- PC0
- PA5
- PB11
- (near R126) PB13
- (near R126) PB5
- PA3
- PB0
- PB1
- PB10
- (near R122) Soldered if reset is
- (near R122) controlled by hardware
- STM324x9I-EVAL USB_OTG_HS
- MB1045
- 8
- 16
- STMicroelectronics
- Title:
- Number:
- Rev:
- Date:
- Sheet          of
- (in symbol 475900001) USB_Micro-AB receptacle

### Library data of the parts
C36 C37 C43-C46 C138 C139 C141 C142 = Cap: Capacitor; Value: 10nF; Published: 8-Jun-2000; Revision: July-2002: Re-released for DXP Platform.; Publisher: Altium Limited
C38 = Cap Pol1: as C54 on sheet Power; Published: 8-Jun-2000; Revision: July-2002: Re-released for DXP Platform.; Publisher: Altium Limited
C40 C41 C49 C137 = CAP: Capacitor
L1 L2 = Inductor: Value: 100uH; Published: 8-Jun-2000; Revision: July-2002: Re-released for DXP Platform.; Publisher: Altium Limited
LD5 LD6 LD9 = LED2: as LD1 on sheet Peripherals; Published: 8-Jun-2000; Revision: July-2002: Re-released for DXP Platform.; Publisher: Altium Limited
R81 R83 R89 R95 R97 R101 R102 R104 R108 R112 R122-R124 R126 R259 R296 R300 R302 = Res1: Resistor; Value: 1K; Published: 8-Jun-2000; Revision: July-2002: Re-released for DXP Platform.; Publisher: Altium Limited
R82 R87 R96 R98 R105 R125 R135 R137 R138 = res1: Resistor; Value: 1K; Published: 8-Jun-2000; Revision: July-2002: Re-released for DXP Platform.; Publisher: Altium Limited
T1 T4 = NPN: as T6 on sheet ST_LINK; Published: 8-Jun-2000; Revision: July-2002: Re-released for DXP Platform.; Publisher: Altium Limited
T7 = PNP: PNP Bipolar Transistor; Code - JEDEC: SOT-23; Published: 8-Jun-2000; Revision: July-2002: Re-released for DXP Platform.; Publisher: Altium Limited
U6 = STMPS2141STR
X5 = CRYSTAL

## Sheet USB_OTG_FS.SchDoc
size A4; Revision: B.2(PCB.SCH)
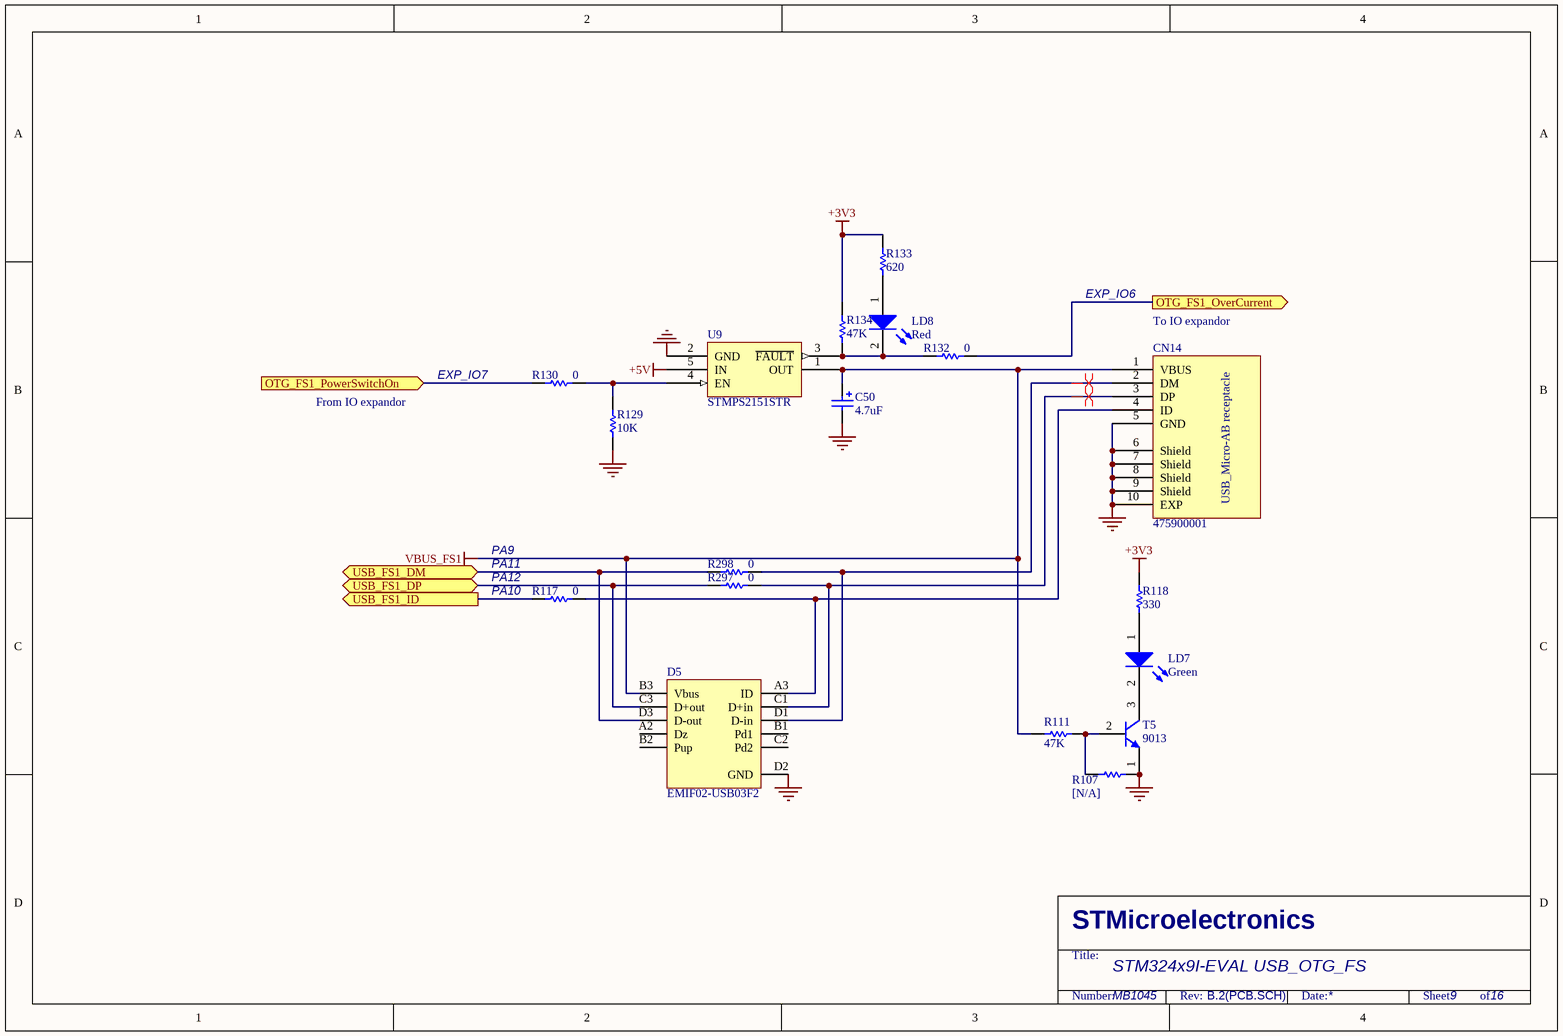
[diagram p11: USB_OTG_FS.SchDoc]

### Parts
C50  4.7uF  [TAN-A]
CN14  475900001  [MOLEX_47590001]
D5  EMIF02-USB03F2  [BGA11_0R5_1R57X2R07]
LD7  Green  [0603D]
LD8  Red  [0603D]
R107  [N/A]  [0603R]
R111  47K  [0603R]
R117  0  [0603R]
R118  330  [0603R]
R129  10K  [0603R]
R130  0  [0603R]
R132  0  [0603R]
R133  620  [0603R]
R134  47K  [0603R]
R297  0  [0603R]
R298  0  [0603R]
T5  9013  [SOT23-213]
U9  STMPS2151STR  [SOT23-5]

### Ports
OTG_FS1_OverCurrent (out), OTG_FS1_PowerSwitchOn (in), USB_FS1_DM (bidir), USB_FS1_DP (bidir), USB_FS1_ID (out)

### Nets
+3V3: R118.2 R133.2 R134.1
+5V: U9.5(IN)
GND: C50.2 CN14.5(GND) CN14.6(Shield) CN14.7(Shield) CN14.8(Shield) CN14.9(Shield) CN14.10(EXP) D5.D2(GND) R107.1 R129.1 T5.1(E) U9.2(GND)
VBUS_FS1: C50.1 CN14.1(VBUS) D5.B3(Vbus) R111.1 U9.1(OUT)
PA10: R117.2 ; port USB_FS1_ID
PA11: D5.D3(D-out) R298.2 ; port USB_FS1_DM
NetCN14_2: CN14.2(DM) D5.D1(D-in) R298.1
NetCN14_3: CN14.3(DP) D5.C1(D+in) R297.1
NetCN14_4: CN14.4(ID) D5.A3(ID) R117.1
NetD5_C3: D5.C3(D+out) R297.2 ; port USB_FS1_DP
NetLD7_1: LD7.1(A) R118.1
NetLD7_2: LD7.2(K) T5.3(C)
NetLD8_1: LD8.1(A) R133.1
NetLD8_2: LD8.2(K) R132.2 R134.2 U9.3(~{FAULT})
NetR107_2: R107.2 R111.2 T5.2(B)
NetR129_2: R129.2 R130.1 U9.4(EN)
NetR130_2: R130.2 ; port OTG_FS1_PowerSwitchOn
NetR132_1: R132.1 ; port OTG_FS1_OverCurrent

Not connected (* = marked no-connect by the designer): D5 A2(Dz) B1(Pd1) B2(Pup) C2(Pd2)

### Layout directives
differential pair: NetCN14_2, NetCN14_3

### Notes on the sheet
- EXP_IO6
- EXP_IO7
- (near CN14) To IO expandor
- From IO expandor
- PA9
- (near R117) PA11
- (near R117) PA12
- (near R117) PA10
- STM324x9I-EVAL USB_OTG_FS
- MB1045
- 9
- 16
- STMicroelectronics
- Title:
- Number:
- Rev:
- Date:
- Sheet          of
- (in symbol 475900001) USB_Micro-AB receptacle

### Library data of the parts
C50 = Cap Pol1: as C54 on sheet Power; Published: 8-Jun-2000; Revision: July-2002: Re-released for DXP Platform.; Publisher: Altium Limited
LD7 LD8 = LED2: as LD1 on sheet Peripherals; Published: 8-Jun-2000; Revision: July-2002: Re-released for DXP Platform.; Publisher: Altium Limited
R107 R111 R118 R134 = res1: Resistor; Value: 1K; Published: 8-Jun-2000; Revision: July-2002: Re-released for DXP Platform.; Publisher: Altium Limited
R117 R129 R130 R132 R133 R297 R298 = Res1: Resistor; Value: 1K; Published: 8-Jun-2000; Revision: July-2002: Re-released for DXP Platform.; Publisher: Altium Limited
T5 = NPN: as T6 on sheet ST_LINK; Published: 8-Jun-2000; Revision: July-2002: Re-released for DXP Platform.; Publisher: Altium Limited
U9 = STMPS2141STR

## Sheet CAN&MicroSDD&IO_Expandor.SchDoc
size A4; Revision: B.2(PCB.SCH)
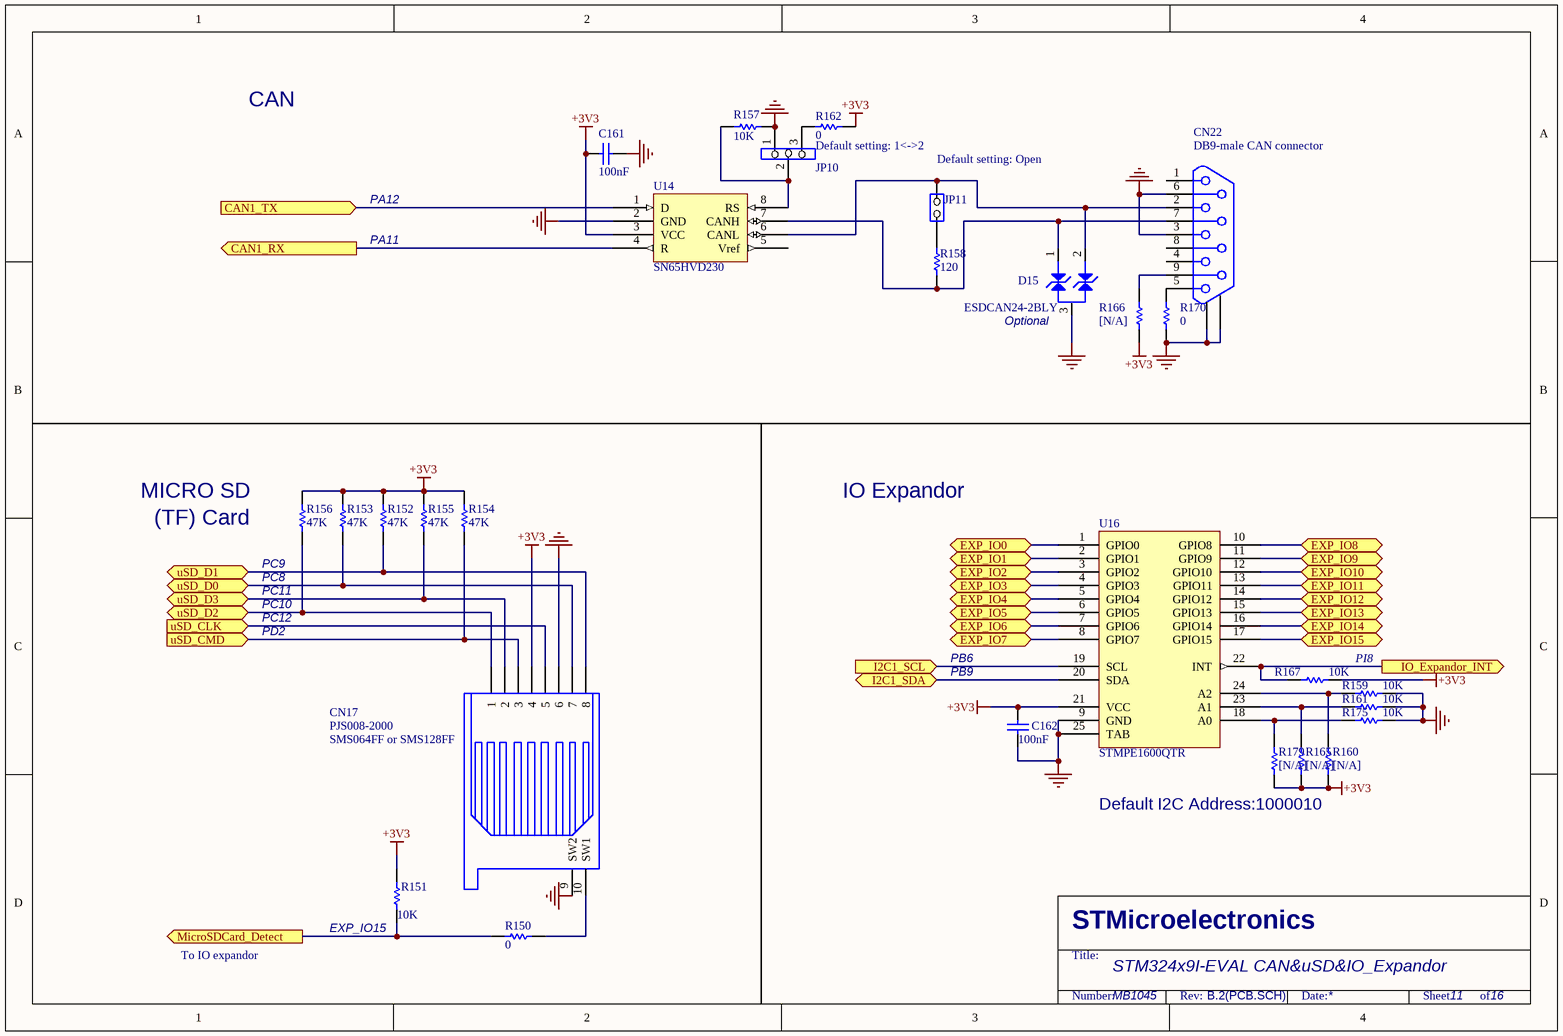
[diagram p12: CAN&MicroSDD&IO_Expandor.SchDoc]

### Parts
C161  100nF  [0603C]
C162  100nF  [0603C]
CN17  PJS008-2000  [MSD_PJS008_]
CN22  DB9-male CAN connector  [DB9/M]
D15  ESDCAN24-2BLY  [SOT23-213]
JP10  (no value)  [SIP3]
JP11  (no value)  [SIP2]
R150  0  [0603R]
R151  10K  [0603R]
R152  47K  [0603R]
R153  47K  [0603R]
R154  47K  [0603R]
R155  47K  [0603R]
R156  47K  [0603R]
R157  10K  [0603R]
R158  120  [0603R]
R159  10K  [0603R]
R160  [N/A]  [0603R]
R161  10K  [0603R]
R162  0  [0603R]
R165  [N/A]  [0603R]
R166  [N/A]  [0603R]
R167  10K  [0603R]
R170  0  [0603R]
R175  10K  [0603R]
R179  [N/A]  [0603R]
U14  SN65HVD230  [SOIC8_1R27_4R9X6]
U16  STMPE1600QTR  [QFN24_0R5_4X4]

### Ports
CAN1_RX (out), CAN1_TX (in), EXP_IO0 (bidir), EXP_IO1 (bidir), EXP_IO2 (bidir), EXP_IO3 (bidir), EXP_IO4 (bidir), EXP_IO5 (bidir), EXP_IO6 (bidir), EXP_IO7 (bidir), EXP_IO8 (bidir), EXP_IO9 (bidir), EXP_IO10 (bidir), EXP_IO11 (bidir), EXP_IO12 (bidir), EXP_IO13 (bidir), EXP_IO14 (bidir), EXP_IO15 (bidir), I2C1_SCL (in), I2C1_SDA (bidir), IO_Expandor_INT (out), MicroSDCard_Detect (out), uSD_CLK (in), uSD_CMD (in), uSD_D0 (bidir), uSD_D1 (bidir), uSD_D2 (bidir), uSD_D3 (bidir)

### Nets
+3V3: C161.1 C162.1 CN17.4 R151.2 R152.1 R153.1 R154.1 R155.1 R156.1 R160.1 R162.2 R165.1 R166.1 R167.1 R179.1 U14.3(VCC) U16.21(VCC)
GND: C161.2 C162.2 CN17.6 CN17.9(SW2) CN22.3 CN22.6 CN22.10 CN22.11 D15.3 JP10.1 R157.2 R159.1 R161.1 R170.1 R175.1 U14.2(GND) U16.9(GND) U16.25(TAB)
I2C1_SCL: U16.19(SCL) ; port I2C1_SCL
I2C1_SDA: U16.20(SDA) ; port I2C1_SDA
PAR_D9: CN17.5 ; port uSD_CLK
PI8: R167.2 U16.22(INT) ; port IO_Expandor_INT
NetB4_1: U16.14(GPIO12) ; port EXP_IO12
NetB4_2: U16.16(GPIO14) ; port EXP_IO14
NetB4_3: U16.15(GPIO13) ; port EXP_IO13
NetB4_4: U16.13(GPIO11) ; port EXP_IO11
NetB4_6: U16.12(GPIO10) ; port EXP_IO10
NetCN5_15: U16.4(GPIO3) ; port EXP_IO3
NetCN17_1: CN17.1 R156.2 ; port uSD_D2
NetCN17_2: CN17.2 R155.2 ; port uSD_D3
NetCN17_3: CN17.3 R154.2 ; port uSD_CMD
NetCN17_7: CN17.7 R153.2 ; port uSD_D0
NetCN17_8: CN17.8 R152.2 ; port uSD_D1
NetCN17_10: CN17.10(SW1) R150.2
NetCN20_39: U16.5(GPIO4) ; port EXP_IO4
NetCN22_2: CN22.2 D15.2 JP11.2(NO) U14.6(CANL)
NetCN22_5: CN22.5 R170.2
NetCN22_7: CN22.7 D15.1 R158.1 U14.7(CANH)
NetCN22_9: CN22.9 R166.2
NetJP10_2: JP10.2 R157.1 U14.8(RS)
NetJP10_3: JP10.3 R162.1
NetJP11_1: JP11.1(COMMON) R158.2
NetJP16_2: U14.4(R) ; port CAN1_RX
NetR76_2: U16.2(GPIO1) ; port EXP_IO1
NetR95_2: U16.11(GPIO9) ; port EXP_IO9
NetR124_1: U16.10(GPIO8) ; port EXP_IO8
NetR130_2: U16.8(GPIO7) ; port EXP_IO7
NetR132_1: U16.7(GPIO6) ; port EXP_IO6
NetR150_1: R150.1 R151.1 U16.17(GPIO15) ; port MicroSDCard_Detect, port EXP_IO15
NetR159_2: R159.2 R160.2 U16.24(A2)
NetR161_2: R161.2 R165.2 U16.23(A1)
NetR175_2: R175.2 R179.2 U16.18(A0)
NetR206_2: U16.3(GPIO2) ; port EXP_IO2
NetR229_2: U16.1(GPIO0) ; port EXP_IO0
NetR256_2: U14.1(D) ; port CAN1_TX
NetU16_6: U16.6(GPIO5) ; port EXP_IO5

Not connected (* = marked no-connect by the designer): CN22 1 4 8; U14 5(Vref)

### Notes on the sheet
- CAN
- Default setting: 1<->2
- (near JP11) Default setting: Open
- PA12
- PA11
- (near D15) Optional
- MICRO SD
- IO Expandor
- (near R156) (TF) Card
- (near R156) PC8
- (near R156) PC9
- PC10
- PC11
- PC12
- PD2
- PB9
- PB6
- PI8
- (near CN17) SMS064FF or SMS128FF
- Default I2C Address:1000010
- To IO expandor
- (near R151) EXP_IO15
- STM324x9I-EVAL CAN&uSD&IO_Expandor
- MB1045
- 11
- 16
- STMicroelectronics
- Title:
- Number:
- Rev:
- Date:
- Sheet          of

### Library data of the parts
C161 C162 = Cap: Capacitor; Value: 10nF; Published: 8-Jun-2000; Revision: July-2002: Re-released for DXP Platform.; Publisher: Altium Limited
CN17 = SMS016AFA5E
CN22 = DB9-CAN
JP10 = Jumper3
JP11 = JP2
R150 R151 R157 R160 R165 R167 R179 = Res1: Resistor; Value: 1K; Published: 8-Jun-2000; Revision: July-2002: Re-released for DXP Platform.; Publisher: Altium Limited
R152-R156 R158 R159 R161 R162 R166 R170 R175 = res1: Resistor; Value: 1K; Published: 8-Jun-2000; Revision: July-2002: Re-released for DXP Platform.; Publisher: Altium Limited
U14 = SN65HVD230D
U16 = STMPE1600

## Sheet ExtensionConnector.SchDoc
size A4; Revision: B.2(PCB.SCH)
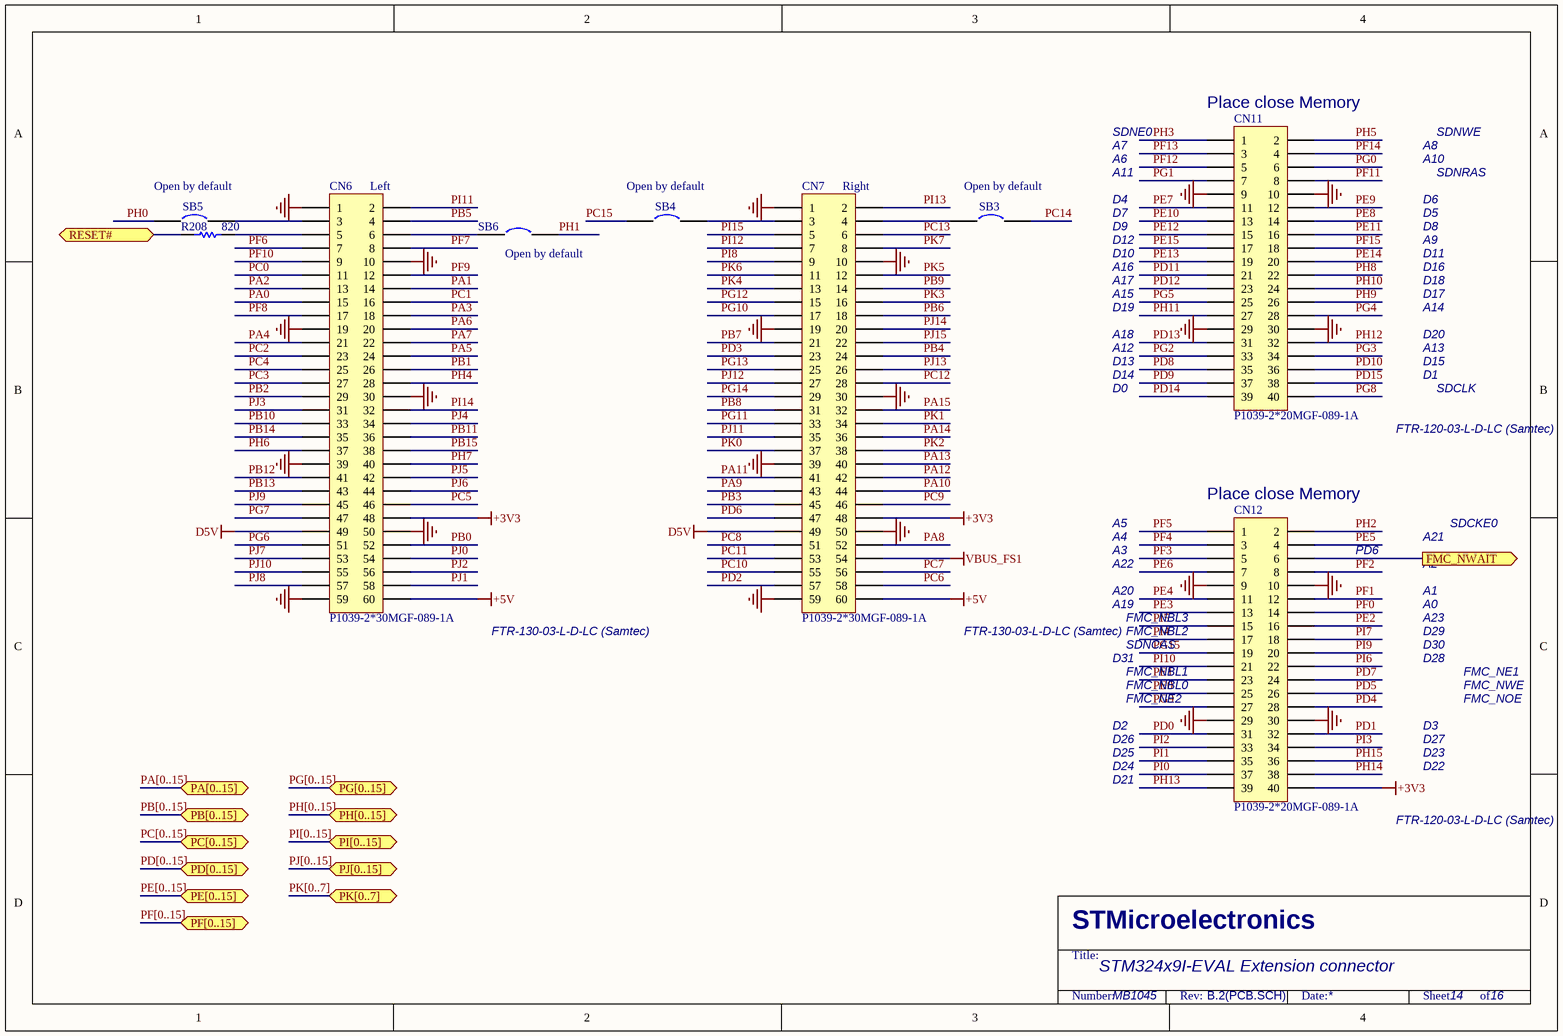
[diagram p13: ExtensionConnector.SchDoc]

### Parts
CN6  P1039-2*30MGF-089-1A  [FTR-130-53-L-D-LC]
CN7  P1039-2*30MGF-089-1A  [FTR-130-53-L-D-LC]
CN11  P1039-2*20MGF-089-1A  [FTR-120-53-L-D-LC]
CN12  P1039-2*20MGF-089-1A  [FTR-120-53-L-D-LC]
R208  820  [0603R]
SB3  (no value)  [JP2_SMD]
SB4  (no value)  [JP2_SMD]
SB5  (no value)  [JP2_SMD]
SB6  (no value)  [JP2_SMD]

### Ports
FMC_NWAIT (out), PA[0..15] (bidir), PB[0..15] (bidir), PC[0..15] (bidir), PD[0..15] (bidir), PE[0..15] (bidir), PF[0..15] (bidir), PG[0..15] (bidir), PH[0..15] (bidir), PI[0..15] (bidir), PJ[0..15] (bidir), PK[0..7] (bidir), RESET# (bidir)

### Nets
+3V3: CN6.48 CN7.48 CN12.40
+5V: CN6.60 CN7.60
D5V: CN6.49 CN7.49
GND: CN6.1 CN6.10 CN6.19 CN6.30 CN6.39 CN6.50 CN6.59 CN7.1 CN7.10 CN7.19 CN7.30 CN7.39 CN7.50 CN7.59 CN11.9 CN11.10 CN11.29 CN11.30 CN12.9 CN12.10 CN12.29 CN12.30
VBUS_FS1: CN7.54
PA0: CN6.15
PA1: CN6.14
PA2: CN6.13
PA3: CN6.18
PA4: CN6.21
PA5: CN6.24
PA6: CN6.20
PA7: CN6.22
PA8: CN7.52
PA9: CN7.43
PA10: CN7.44
PA11: CN7.41
PA12: CN7.42
PA13: CN7.40
PA14: CN7.36
PA15: CN7.32
PB0: CN6.52
PB1: CN6.26
PB2: CN6.29
PB3: CN7.45
PB4: CN7.24
PB5: CN6.4
PB6: CN7.18  [project net I2C1_SCL]
PB7: CN7.21
PB8: CN7.31  [project net PAR_D6]
PB9: CN7.14  [project net I2C1_SDA]
PB10: CN6.33
PB11: CN6.36
PB12: CN6.41
PB13: CN6.43
PB14: CN6.35
PB15: CN6.38
PC0: CN6.11
PC1: CN6.16
PC2: CN6.23
PC3: CN6.27
PC4: CN6.25
PC5: CN6.46
PC6: CN7.58  [project net I2S3_CK]
PC7: CN7.56  [project net PAR_D1]
PC8: CN7.51  [project net PAR_D2]
PC9: CN7.46  [project net PAR_D3]
PC10: CN7.55  [project net PAR_D8]
PC11: CN7.53  [project net PAR_D4]
PC12: CN7.28  [project net PAR_D9]
PC13: CN7.6
PC14: SB3.1
PC15: SB4.1
PD0: CN12.31  [project net D2]
PD1: CN12.32  [project net D3]
PD2: CN7.57  [project net PAR_D11]
PD3: CN7.23  [project net PAR_D5]
PD4: CN12.28
PD5: CN12.26
PD6: CN7.47  [project net PAR_D10]
PD7: CN12.24
PD8: CN11.35  [project net D13]
PD9: CN11.37  [project net D14]
PD10: CN11.36  [project net D15]
PD11: CN11.21  [project net A16]
PD12: CN11.23  [project net A17]
PD13: CN11.31  [project net A18]
PD14: CN11.39  [project net D0]
PD15: CN11.38  [project net D1]
PE0: CN12.25
PE1: CN12.23
PE2: CN12.16  [project net A23]
PE3: CN12.13  [project net A19]
PE4: CN12.11  [project net A20]
PE5: CN12.4  [project net A21]
PE6: CN12.7  [project net A22]
PE7: CN11.11  [project net D4]
PE8: CN11.14  [project net D5]
PE9: CN11.12  [project net D6]
PE10: CN11.13  [project net D7]
PE11: CN11.16  [project net D8]
PE12: CN11.15  [project net D9]
PE13: CN11.19  [project net D10]
PE14: CN11.20  [project net D11]
PE15: CN11.17  [project net D12]
PF0: CN12.14  [project net A0]
PF1: CN12.12  [project net A1]
PF2: CN12.8  [project net A2]
PF3: CN12.5  [project net A3]
PF4: CN12.3  [project net A4]
PF5: CN12.1  [project net A5]
PF6: CN6.7
PF7: CN6.8
PF8: CN6.17
PF9: CN6.12
PF10: CN6.9
PF11: CN11.8
PF12: CN11.5  [project net A6]
PF13: CN11.3  [project net A7]
PF14: CN11.4  [project net A8]
PF15: CN11.18  [project net A9]
PG0: CN11.6  [project net A10]
PG1: CN11.7  [project net A11]
PG2: CN11.33  [project net A12]
PG3: CN11.34  [project net A13]
PG4: CN11.28  [project net A14]
PG5: CN11.25  [project net A15]
PG6: CN6.51
PG7: CN6.47
PG8: CN11.40
PG9: CN12.27
PG10: CN7.17
PG11: CN7.33
PG12: CN7.15
PG13: CN7.25
PG14: CN7.29
PG15: CN12.19
PH0: SB5.1
PH1: SB6.1
PH2: CN12.2
PH3: CN11.1
PH4: CN6.28
PH5: CN11.2
PH6: CN6.37
PH7: CN6.40
PH8: CN11.22  [project net D16]
PH9: CN11.26  [project net D17]
PH10: CN11.24  [project net D18]
PH11: CN11.27  [project net D19]
PH12: CN11.32  [project net D20]
PH13: CN12.39  [project net D21]
PH14: CN12.38  [project net D22]
PH15: CN12.36  [project net D23]
PI0: CN12.37  [project net D24]
PI1: CN12.35  [project net D25]
PI2: CN12.33  [project net D26]
PI3: CN12.34  [project net D27]
PI4: CN12.17
PI5: CN12.15
PI6: CN12.22  [project net D28]
PI7: CN12.18  [project net D29]
PI8: CN7.9
PI9: CN12.20  [project net D30]
PI10: CN12.21  [project net D31]
PI11: CN6.2
PI12: CN7.7
PI13: CN7.2
PI14: CN6.32
PI15: CN7.5  [project net LCD_R0]
PJ0: CN6.54  [project net LCD_R1]
PJ1: CN6.58  [project net LCD_R2]
PJ2: CN6.56  [project net LCD_R3]
PJ3: CN6.31  [project net LCD_R4]
PJ4: CN6.34  [project net LCD_R5]
PJ5: CN6.42  [project net LCD_R6]
PJ6: CN6.44  [project net LCD_R7]
PJ7: CN6.53  [project net LCD_G0]
PJ8: CN6.57  [project net LCD_G1]
PJ9: CN6.45  [project net LCD_G2]
PJ10: CN6.55  [project net LCD_G3]
PJ11: CN7.35  [project net LCD_G4]
PJ12: CN7.27  [project net LCD_B0]
PJ13: CN7.26  [project net LCD_B1]
PJ14: CN7.20  [project net LCD_B2]
PJ15: CN7.22  [project net LCD_B3]
PK0: CN7.37  [project net LCD_G5]
PK1: CN7.34  [project net LCD_G6]
PK2: CN7.38  [project net LCD_G7]
PK3: CN7.16  [project net LCD_B4]
PK4: CN7.13  [project net LCD_B5]
PK5: CN7.12  [project net LCD_B6]
PK6: CN7.11  [project net LCD_B7]
PK7: CN7.8
RESET#: R208.1 ; port RESET#
NetCN6_3: CN6.3 SB5.2
NetCN6_5: CN6.5 R208.2
NetCN6_6: CN6.6 SB6.2
NetCN7_3: CN7.3 SB4.2
NetCN7_4: CN7.4 SB3.2
NetCN12_6: CN12.6 ; port FMC_NWAIT

### Buses and harness runs
bus PA[0..15] = port PA[0..15]
bus PB[0..15] = port PB[0..15]
bus PC[0..15] = port PC[0..15]
bus PD[0..15] = port PD[0..15]
bus PE[0..15] = port PE[0..15]
bus PF[0..15] = port PF[0..15]
bus PG[0..15] = port PG[0..15]
bus PH[0..15] = port PH[0..15]
bus PI[0..15] = port PI[0..15]
bus PJ[0..15] = port PJ[0..15]
bus PK[0..7] = port PK[0..7]

### Notes on the sheet
- (near CN11) Place close Memory
- A6
- A7
- A11
- SDNE0
- A8
- A10
- SDNRAS
- SDNWE
- Open by default
- (near CN6) Left
- (near SB4) Open by default
- (near CN7) Right
- (near SB3) Open by default
- D4
- D7
- D9
- D12
- D5
- D6
- D8
- A9
- (near SB6) Open by default
- A16
- A17
- D10
- A15
- D19
- D11
- A14
- D16
- D17
- D18
- D13
- D14
- A18
- A12
- D15
- D1
- A13
- D20
- D0
- (near CN11) FTR-120-03-L-D-LC (Samtec)
- SDCLK
- (near CN12) Place close Memory
- A22
- A3
- A4
- A5
- PD6
- A21
- A2
- SDCKE0
- (near CN6) FTR-130-03-L-D-LC (Samtec)
- (near CN7) FTR-130-03-L-D-LC (Samtec)
- A19
- A20
- SDNCAS
- FMC_NBL2
- FMC_NBL3
- A23
- A0
- A1
- D29
- D30
- D31
- FMC_NBL0
- FMC_NBL1
- FMC_NE2
- D28
- FMC_NOE
- FMC_NWE
- FMC_NE1
- D2
- D21
- D24
- D25
- D26
- D3
- D22
- D23
- D27
- (near CN12) FTR-120-03-L-D-LC (Samtec)
- STM324x9I-EVAL Extension connector
- MB1045
- 14
- 16
- STMicroelectronics
- Title:
- Number:
- Rev:
- Date:
- Sheet          of

### Library data of the parts
CN6 CN7 = FTR-130-53-L-D-LC: Header, 40-Pin, Dual row; Revision: 17-Jul-2002: Re-released for DXP Platform.; Publisher: Altium Limited
CN11 CN12 = FTR-120-53-L-D-LC: Header, 20-Pin, Dual row; Revision: 17-Jul-2002: Re-released for DXP Platform.; Publisher: Altium Limited
R208 = res1: Resistor; Value: 1K; Published: 8-Jun-2000; Revision: July-2002: Re-released for DXP Platform.; Publisher: Altium Limited
SB3-SB6 = Circuit Breaker: Published: 24-Mar-1999; Revision: July-2002: Re-released for DXP Platform.; Publisher: Altium Limited

## Sheet LCD&Camera&Connectors.SchDoc
size A4; Revision: B.2(PCB.SCH)
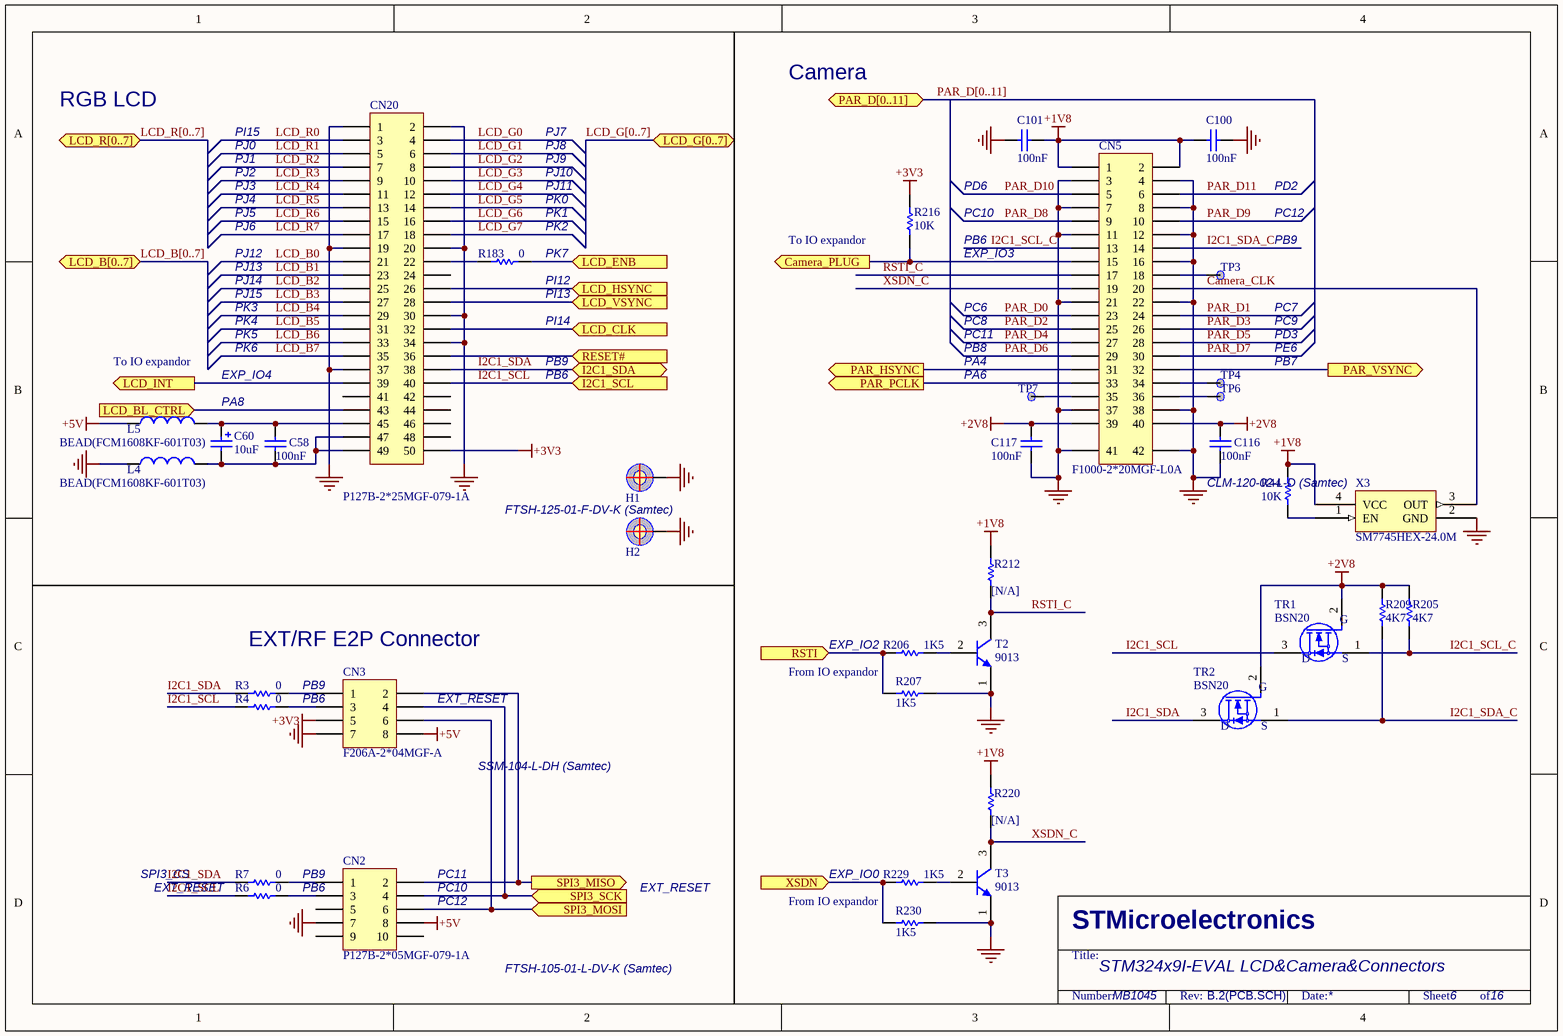
[diagram p14: LCD&Camera&Connectors.SchDoc]

### Parts
C58  100nF  [0603C]
C60  10uF  [TAN-A]
C100  100nF  [0603C]
C101  100nF  [0603C]
C116  100nF  [0603C]
C117  100nF  [0603C]
CN2  P127B-2*05MGF-079-1A  [FTSH-105-01-L-DV-K]
CN3  F206A-2*04MGF-A  [SSM-104-L-DH]
CN5  F1000-2*20MGF-L0A  [CLM-120-02-L-D]
CN20  P127B-2*25MGF-079-1A  [FTSH-125-01-F-DV]
H1  POSITION HOLE  [HOLE_C9D4R5]  (value not drawn)
H2  POSITION HOLE  [HOLE_C9D4R5]  (value not drawn)
L4  BEAD(FCM1608KF-601T03)  [0603L]
L5  BEAD(FCM1608KF-601T03)  [0603L]
R3  0  [0603R]
R4  0  [0603R]
R6  0  [0603R]
R7  0  [0603R]
R44  10K  [0402R]
R183  0  [0603R]
R205  4K7  [0603R]
R206  1K5  [0603R]
R207  1K5  [0603R]
R209  4K7  [0603R]
R212  [N/A]  [0603R]
R216  10K  [0603R]
R220  [N/A]  [0603R]
R229  1K5  [0603R]
R230  1K5  [0603R]
T2  9013  [SOT23-213]
T3  9013  [SOT23-213]
TP3  (no value)  [TP]
TP4  (no value)  [TP]
TP6  (no value)  [TP]
TP7  (no value)  [TP]
TR1  BSN20  [SOT23-213]
TR2  BSN20  [SOT23-213]
X3  SM7745HEX-24.0M  [OSC_4SM_7X5]

### Ports
Camera_PLUG (out), I2C1_SCL (in), I2C1_SDA (bidir), LCD_B[0..7] (bidir), LCD_BL_CTRL (in), LCD_CLK (in), LCD_ENB (in), LCD_G[0..7] (bidir), LCD_HSYNC (in), LCD_INT (out), LCD_R[0..7] (bidir), LCD_VSYNC (in), PAR_D[0..11] (bidir), PAR_HSYNC (out), PAR_PCLK (out), PAR_VSYNC (out), RESET# (in), RSTI (in), SPI3_MISO (out), SPI3_MOSI (in), SPI3_SCK (in), XSDN (in)

### Nets
+1V8: C100.1 C101.2 CN5.1 CN5.2 R44.2 R212.2 R220.2 X3.4(VCC)
+2V8: C116.1 C117.1 CN5.39 CN5.40 R205.2 R209.2 TR1.2(G) TR2.2(G)
+3V3: CN3.5 CN20.50 R216.1
+5V: CN2.8 CN3.8 L5.1
GND: C100.2 C101.1 C116.2 C117.2 CN2.7 CN3.7 CN5.3 CN5.4 CN5.7 CN5.8 CN5.11 CN5.12 CN5.16 CN5.21 CN5.22 CN5.37 CN5.38 CN5.41 CN5.42 CN20.1 CN20.2 CN20.19 CN20.20 CN20.30 CN20.34 CN20.37 H1.1 H2.1 L4.1 R207.2 R230.2 T2.1(E) T3.1(E) X3.2(GND)
Camera_CLK: CN5.20 X3.3(OUT)
I2C1_SCL: CN20.40 R4.1 R6.1 TR1.3(D) ; port I2C1_SCL
I2C1_SCL_C: CN5.13 R205.1 TR1.1(S)
I2C1_SDA: CN20.38 R3.1 R7.1 TR2.3(D) ; port I2C1_SDA
I2C1_SDA_C: CN5.14 R209.1 TR2.1(S)
LCD_B0: CN20.21
LCD_B1: CN20.23
LCD_B2: CN20.25
LCD_B3: CN20.27
LCD_B4: CN20.29
LCD_B5: CN20.31
LCD_B6: CN20.33
LCD_B7: CN20.35
LCD_G0: CN20.4
LCD_G1: CN20.6
LCD_G2: CN20.8
LCD_G3: CN20.10
LCD_G4: CN20.12
LCD_G5: CN20.14
LCD_G6: CN20.16
LCD_G7: CN20.18
LCD_R0: CN20.3
LCD_R1: CN20.5
LCD_R2: CN20.7
LCD_R3: CN20.9
LCD_R4: CN20.11
LCD_R5: CN20.13
LCD_R6: CN20.15
LCD_R7: CN20.17
PA4: CN5.31 ; port PAR_HSYNC
PA6: CN5.33 ; port PAR_PCLK
PAR_D0: CN5.23  [project net I2S3_CK]
PAR_D1: CN5.24
PAR_D2: CN5.25
PAR_D3: CN5.26
PAR_D4: CN2.2 CN3.2 CN5.27 ; port SPI3_MISO
PAR_D5: CN5.28
PAR_D6: CN5.29
PAR_D7: CN5.30
PAR_D8: CN2.4 CN3.4 CN5.9 ; port SPI3_SCK
PAR_D9: CN2.6 CN3.6 CN5.10 ; port SPI3_MOSI
PAR_D10: CN5.5
PAR_D11: CN5.6
PB7: CN5.32 ; port PAR_VSYNC
PI12: CN20.26 ; port LCD_HSYNC
PI13: CN20.28 ; port LCD_VSYNC
PI14: CN20.32 ; port LCD_CLK
PK7: R183.2 ; port LCD_ENB
RESET#: CN20.36 ; port RESET#
RSTI_C: CN5.17 R212.1 T2.3(C)
XSDN_C: CN5.19 R220.1 T3.3(C)
NetC58_1: C58.1 C60.1 CN20.45 L5.2
NetC58_2: C58.2 C60.2 CN20.47 CN20.49 L4.2
NetCN2_1: CN2.1 R7.2
NetCN2_3: CN2.3 R6.2
NetCN3_1: CN3.1 R3.2
NetCN3_3: CN3.3 R4.2
NetCN5_15: CN5.15 R216.2 ; port Camera_PLUG
NetCN5_18: CN5.18 TP3.1
NetCN5_34: CN5.34 TP4.1
NetCN5_35: CN5.35 TP7.1
NetCN5_36: CN5.36 TP6.1
NetCN20_22: CN20.22 R183.1
NetCN20_39: CN20.39 ; port LCD_INT
NetCN20_43: CN20.43 ; port LCD_BL_CTRL
NetR44_1: R44.1 X3.1(EN)
NetR206_1: R206.1 T2.2(B)
NetR206_2: R206.2 R207.1 ; port RSTI
NetR229_1: R229.1 T3.2(B)
NetR229_2: R229.2 R230.1 ; port XSDN

Not connected (* = marked no-connect by the designer): CN2 5 9 10; CN20 24 41 42 44 46 48

### Buses and harness runs
bus LCD_B[0..7] = port LCD_B[0..7]
bus LCD_G[0..7] = port LCD_G[0..7]
bus LCD_R[0..7] = port LCD_R[0..7]
bus PAR_D[0..11] = port PAR_D[0..11]

### Notes on the sheet
- RGB LCD
- Camera
- PI15
- PJ0
- PJ1
- PJ2
- PJ7
- PJ8
- PJ9
- PJ10
- PJ3
- PJ4
- PJ5
- PJ6
- PJ11
- PK0
- (near R183) PK1
- (near R183) PK2
- (near R216) To IO expandor
- PC10
- PB6
- PD6
- PB9
- PD2
- PC12
- PJ12
- PJ13
- PJ14
- PJ15
- PK3
- (near R183) PK7
- (near R183) PI12
- (near R183) PI13
- PC6
- EXP_IO3
- PC7
- To IO expandor
- EXP_IO4
- PK4
- PK5
- PK6
- PI14
- PC11
- PB8
- PA4
- PA6
- PC8
- PE6
- PC9
- PB7
- PD3
- PA8
- FTSH-125-01-F-DV-K (Samtec)
- CLM-120-02-L-D (Samtec)
- EXT/RF E2P Connector
- (near R206) EXP_IO2
- (near CN3) EXT_RESET
- From IO expandor
- (near CN3) SSM-104-L-DH (Samtec)
- SPI3_CS
- EXT_RESET
- (near CN2) PC12
- (near CN2) PC11
- (near CN2) PC10
- (near R229) EXP_IO0
- (near CN2) FTSH-105-01-L-DV-K (Samtec)
- STM324x9I-EVAL LCD&Camera&Connectors
- MB1045
- 6
- 16
- STMicroelectronics
- Title:
- Number:
- Rev:
- Date:
- Sheet          of

### Library data of the parts
C58 C100 C101 C116 C117 = Cap: Capacitor; Value: 10nF; Published: 8-Jun-2000; Revision: July-2002: Re-released for DXP Platform.; Publisher: Altium Limited
C60 = Cap Pol1: Polarized Capacitor (Radial); Published: 8-Jun-2000; Revision: July-2002: Re-released for DXP Platform.; Publisher: Altium Limited; Value: 10uF
CN2 = FTSH-15-01-L-DV-ES-K: Header, 5-Pin, Dual row; Revision: 17-Jul-2002: Re-released for DXP Platform.; Publisher: Altium Limited
CN3 = SSM-104-L-DH: Header, 5-Pin, Dual row; Revision: 17-Jul-2002: Re-released for DXP Platform.; Publisher: Altium Limited
CN5 = CLM-120-02-L-D: Header, 20-Pin, Dual row; Revision: 17-Jul-2002: Re-released for DXP Platform.; Publisher: Altium Limited
CN20 = Header 25X2: Header, 26-Pin, Dual row; Revision: 17-Jul-2002: Re-released for DXP Platform.; Publisher: Altium Limited
L4 L5 = Inductor: Value: 100uH; Published: 8-Jun-2000; Revision: July-2002: Re-released for DXP Platform.; Publisher: Altium Limited
R3 R4 R6 R7 R44 R183 R206 R207 R216 R229 R230 = Res1: Resistor; Value: 1K; Published: 8-Jun-2000; Revision: July-2002: Re-released for DXP Platform.; Publisher: Altium Limited
R205 R209 R212 R220 = res1: Resistor; Value: 1K; Published: 8-Jun-2000; Revision: July-2002: Re-released for DXP Platform.; Publisher: Altium Limited
T2 T3 = NPN: as T6 on sheet ST_LINK; Published: 8-Jun-2000; Revision: July-2002: Re-released for DXP Platform.; Publisher: Altium Limited
TP3 TP4 TP6 TP7 = TP
TR1 TR2 = 2N7000
X3 = SM7745HEV-50.0M